# Altium project RaspComputeModule_4_IO.PrjPcb
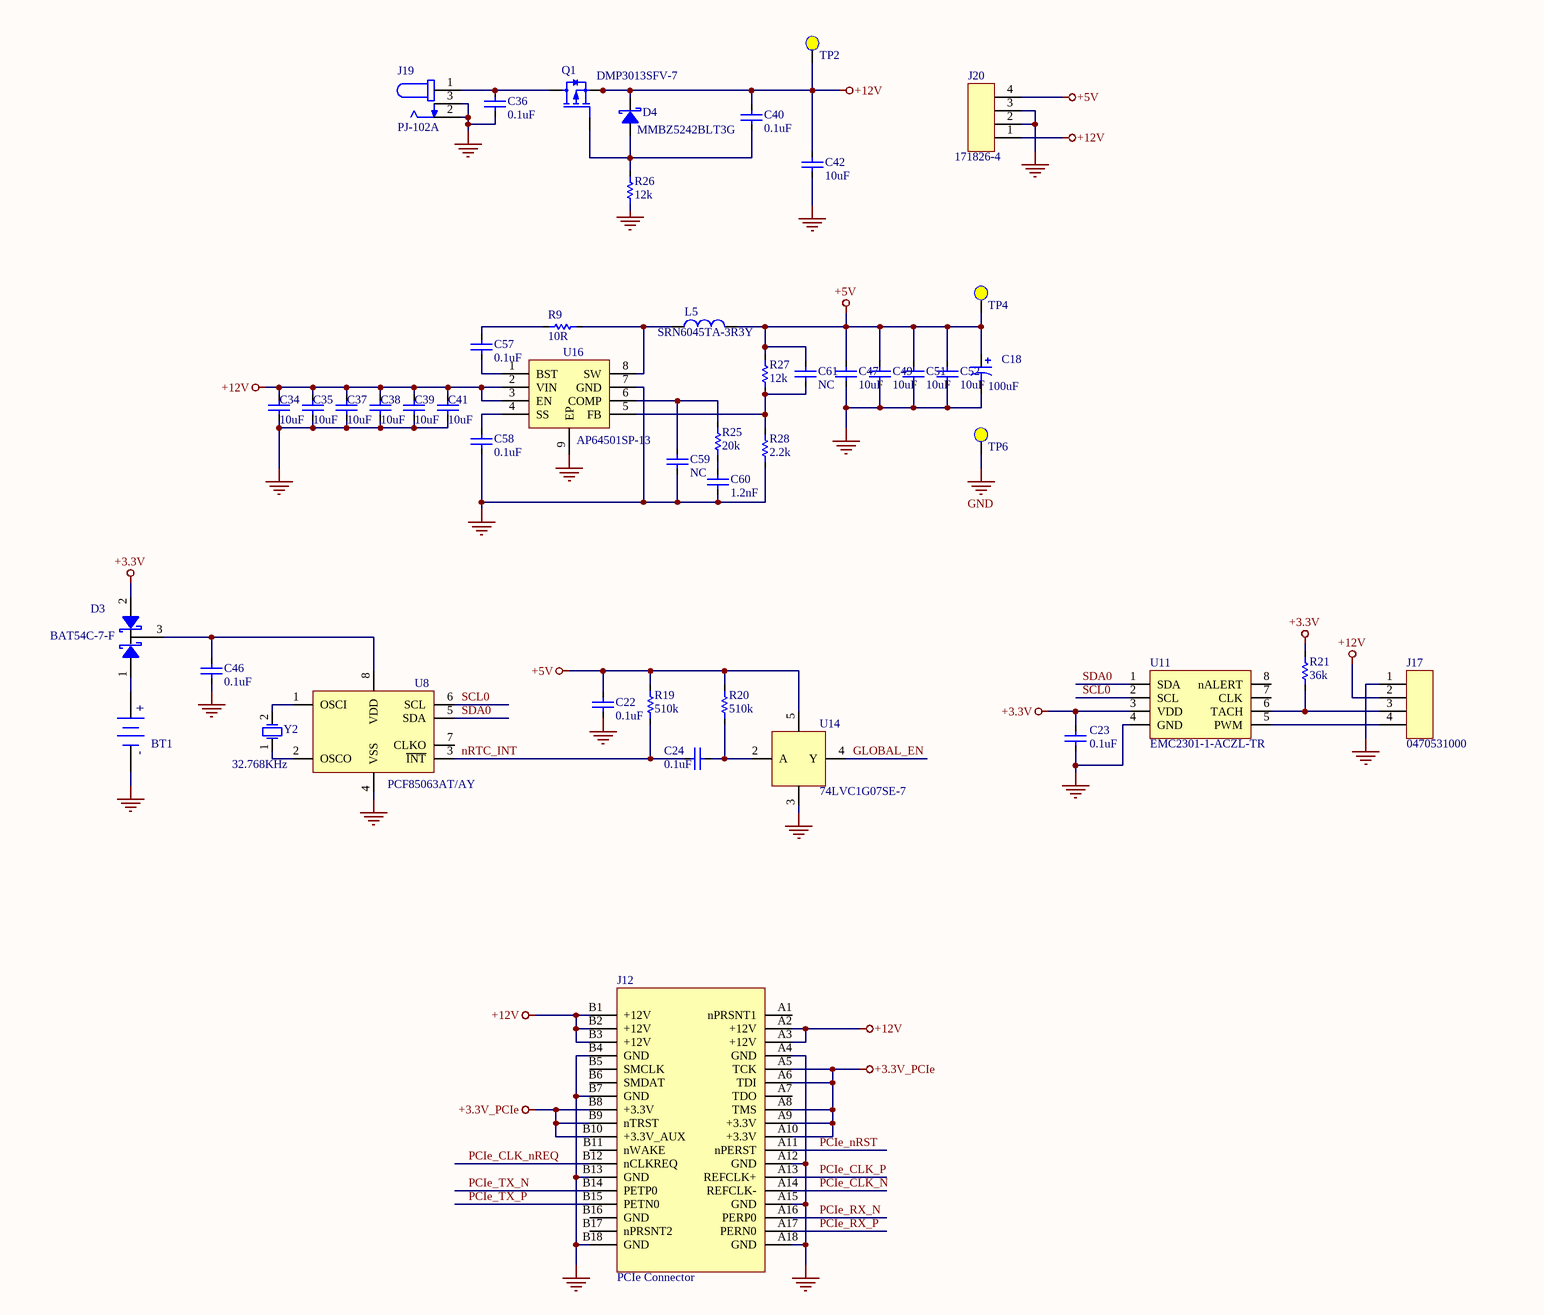
[diagram p0: RaspComputeModule_4_IO.SchDoc, top left]
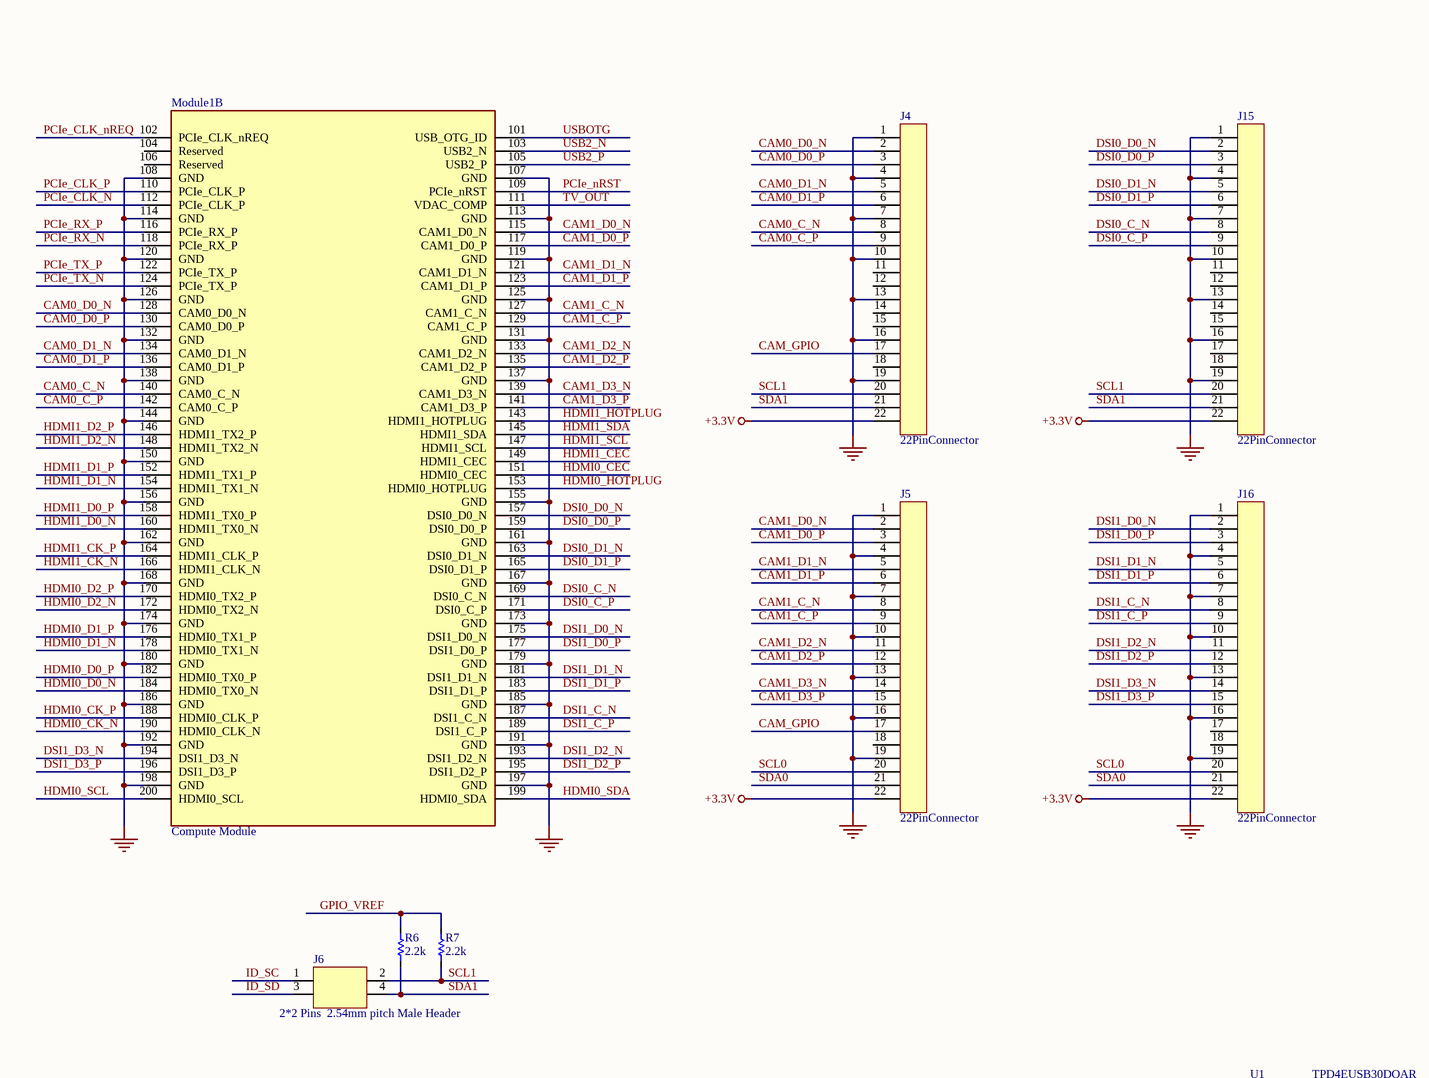
[diagram p1: RaspComputeModule_4_IO.SchDoc, top right]
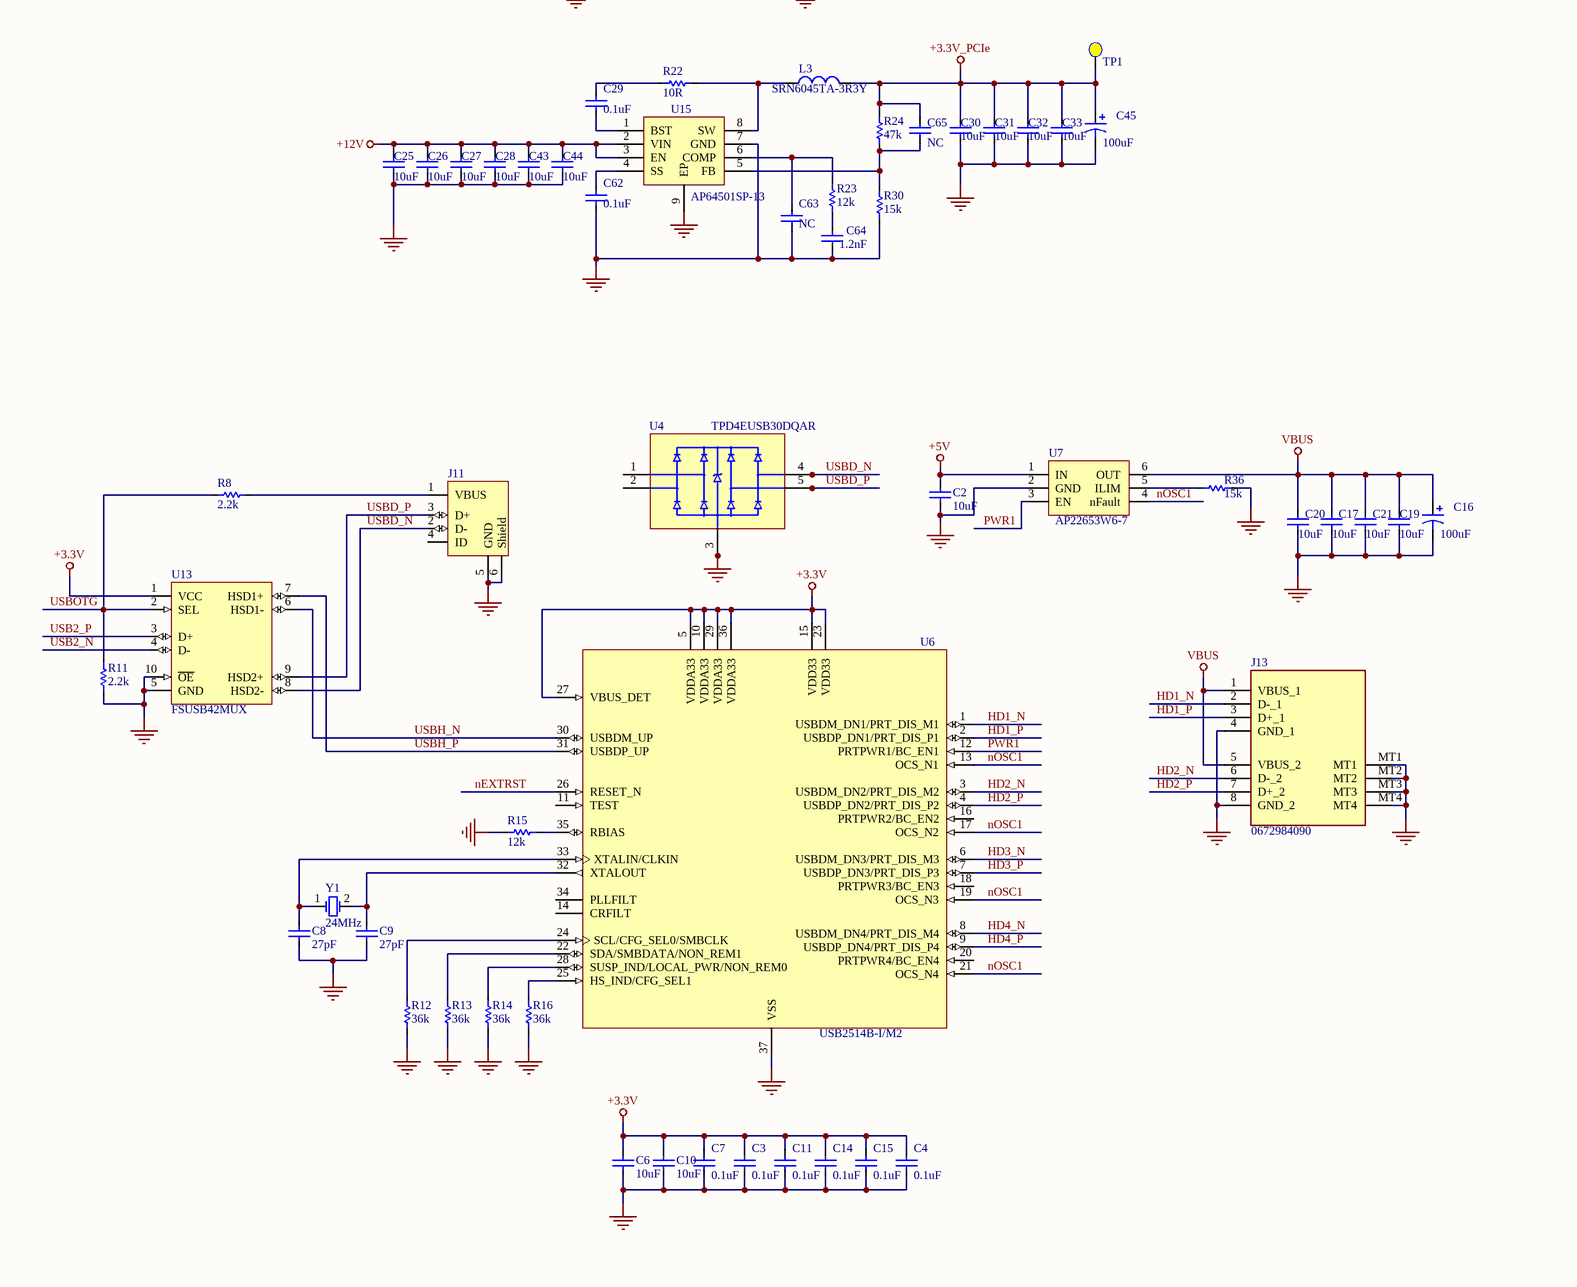
[diagram p2: RaspComputeModule_4_IO.SchDoc, bottom left]
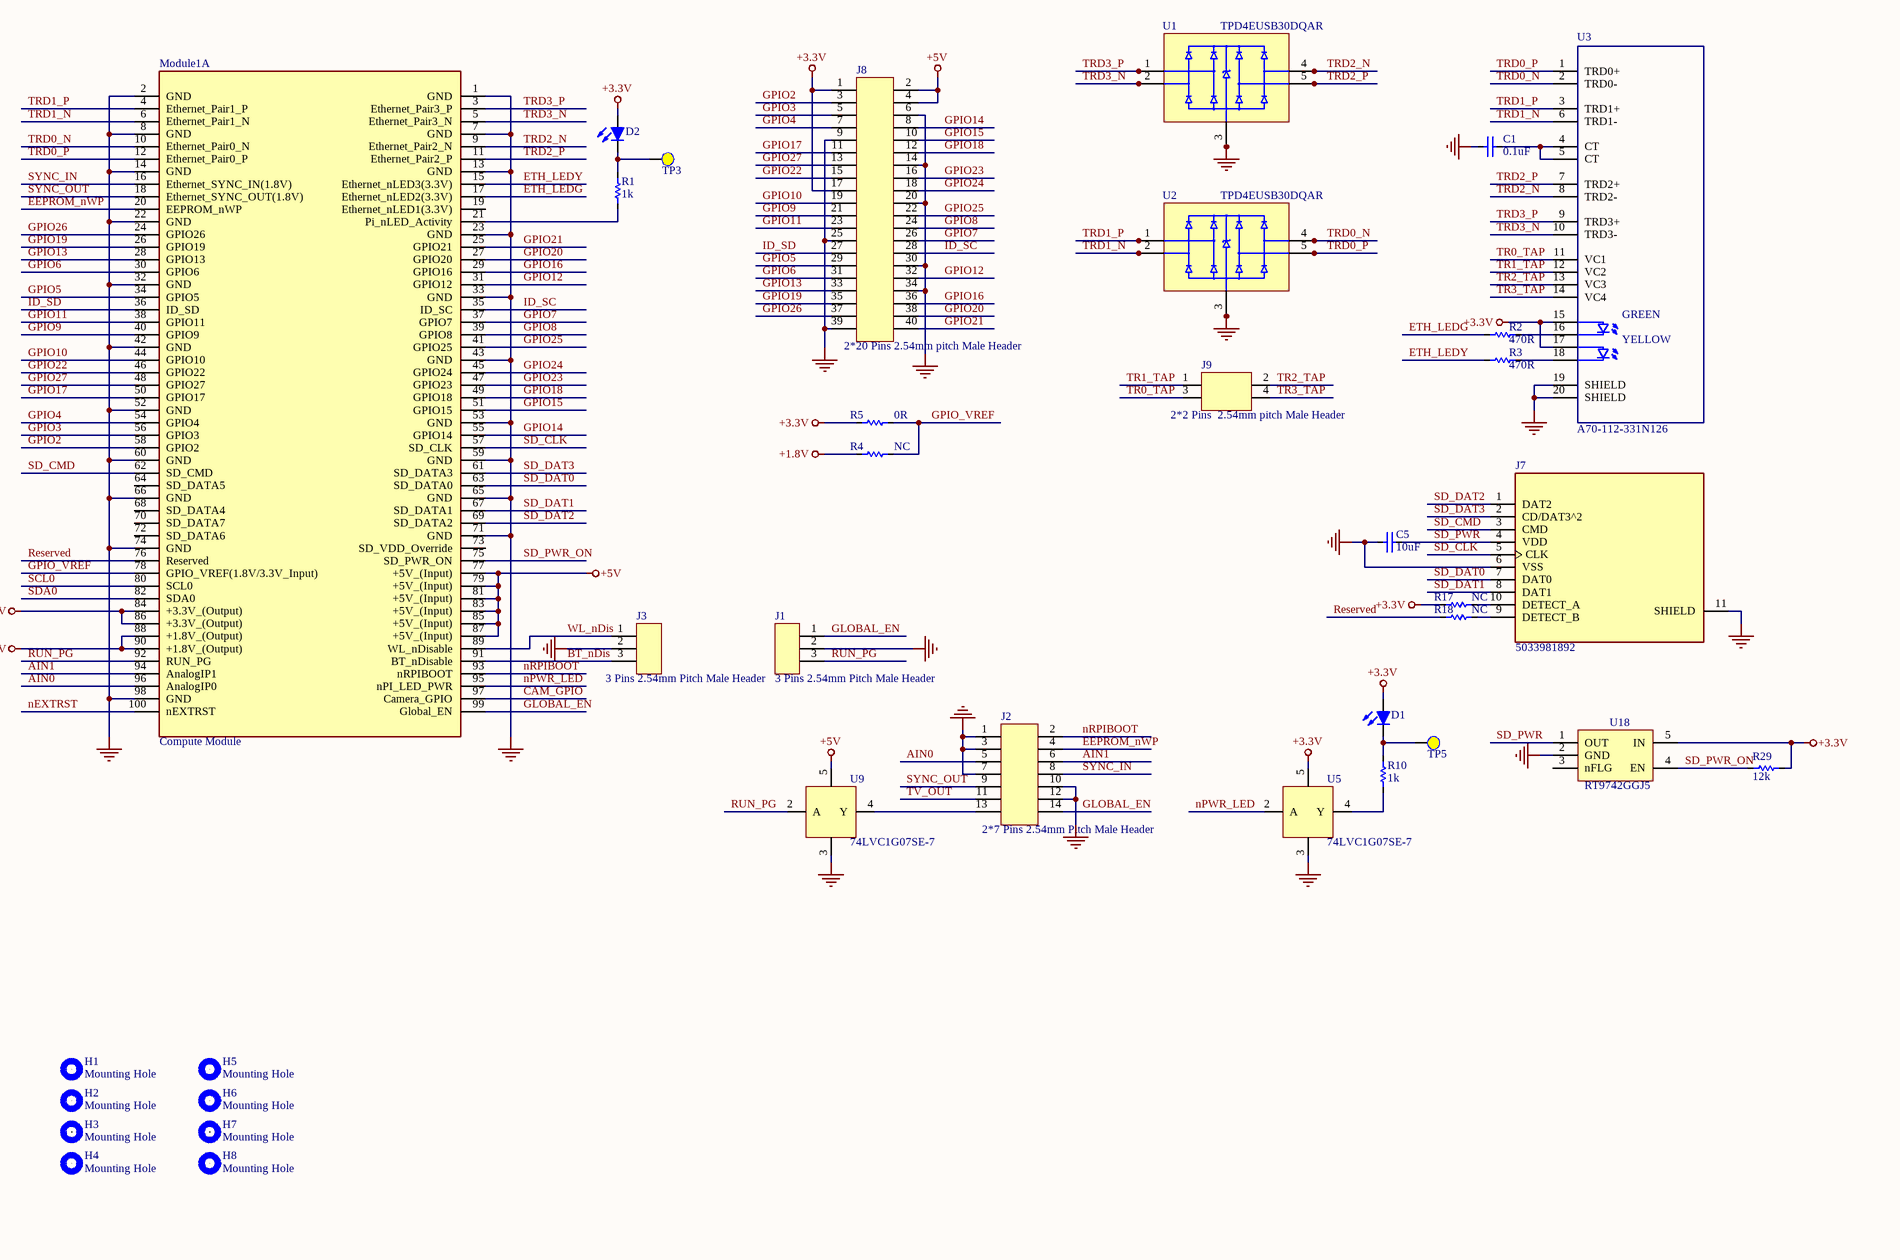
[diagram p3: RaspComputeModule_4_IO.SchDoc, bottom right]
2 sheets, 263 parts. Net scope: global (net labels, ports and power ports of the same name join across sheets).
Board files: Sim7600.PcbDoc, RaspComputeModule_4_IO.PcbDoc
Sheets:
  RaspComputeModule_4_IO.SchDoc
  SIM7600G.SchDoc

## Sheet RaspComputeModule_4_IO.SchDoc
size A1

### Parts
BT1  3034  [BatteryHolder_Keystone_3034_1x20mm]  (value not drawn)
C1  0.1uF  [C_0402_1005Metric]
C2  10uF  [C_0805_2012Metric]
C3  0.1uF  [C_0402_1005Metric]
C4  0.1uF  [C_0402_1005Metric]
C5  10uF  [C_0805_2012Metric]
C6  10uF  [C_0805_2012Metric]
C7  0.1uF  [C_0402_1005Metric]
C8  27pF  [C_0402_1005Metric]
C9  27pF  [C_0402_1005Metric]
C10  10uF  [C_0805_2012Metric]
C11  0.1uF  [C_0402_1005Metric]
C14  0.1uF  [C_0402_1005Metric]
C15  0.1uF  [C_0402_1005Metric]
C16  100uF  [CP_EIA-7343-31_Kemet-D]
C17  10uF  [C_0805_2012Metric]
C18  100uF  [CP_EIA-7343-31_Kemet-D]
C19  10uF  [C_0805_2012Metric]
C20  10uF  [C_0805_2012Metric]
C21  10uF  [C_0805_2012Metric]
C22  0.1uF  [C_0402_1005Metric]
C23  0.1uF  [C_0402_1005Metric]
C24  0.1uF  [C_0402_1005Metric]
C25  10uF  [C_0805_2012Metric]
C26  10uF  [C_0805_2012Metric]
C27  10uF  [C_0805_2012Metric]
C28  10uF  [C_0805_2012Metric]
C29  0.1uF  [C_0402_1005Metric]
C30  10uF  [C_0805_2012Metric]
C31  10uF  [C_0805_2012Metric]
C32  10uF  [C_0805_2012Metric]
C33  10uF  [C_0805_2012Metric]
C34  10uF  [C_0805_2012Metric]
C35  10uF  [C_0805_2012Metric]
C36  0.1uF  [C_0402_1005Metric]
C37  10uF  [C_0805_2012Metric]
C38  10uF  [C_0805_2012Metric]
C39  10uF  [C_0805_2012Metric]
C40  0.1uF  [C_0402_1005Metric]
C41  10uF  [C_0805_2012Metric]
C42  10uF  [C_0805_2012Metric]
C43  10uF  [C_0805_2012Metric]
C44  10uF  [C_0805_2012Metric]
C45  100uF  [CP_EIA-7343-31_Kemet-D]
C46  0.1uF  [C_0402_1005Metric]
C47  10uF  [C_0805_2012Metric]
C49  10uF  [C_0805_2012Metric]
C51  10uF  [C_0805_2012Metric]
C52  10uF  [C_0805_2012Metric]
C57  0.1uF  [C_0402_1005Metric]
C58  0.1uF  [C_0402_1005Metric]
C59  NC  [C_0402_1005Metric]
C60  1.2nF  [C_0402_1005Metric]
C61  NC  [C_0402_1005Metric]
C62  0.1uF  [C_0402_1005Metric]
C63  NC  [C_0402_1005Metric]
C64  1.2nF  [C_0402_1005Metric]
C65  NC  [C_0402_1005Metric]
D1  SML-D12U1WT86  [LED_0603_1608Metric]  (value not drawn)
D2  SML-D12U1WT86  [LED_0603_1608Metric]  (value not drawn)
D3  BAT54C-7-F  [SOT-23]
D4  MMBZ5242BLT3G  [D_SOT-23_ANK]
H1  Mounting Hole  [MountingHole_2.7mm_M2.5]
H2  Mounting Hole  [MountingHole_2.7mm_M2.5]
H3  Mounting Hole  [MountingHole_2.7mm_M2.5]
H4  Mounting Hole  [MountingHole_2.7mm_M2.5]
H5  Mounting Hole  [MountingHole_2.7mm_M2.5]
H6  Mounting Hole  [MountingHole_2.7mm_M2.5]
H7  Mounting Hole  [MountingHole_2.7mm_M2.5]
H8  Mounting Hole  [MountingHole_2.7mm_M2.5]
J1  3 Pins 2.54mm Pitch Male Header  [PinHeader_1x03_P2.54mm_Vertical]
J2  2*7 Pins 2.54mm Pitch Male Header  [PinHeader_2x07_P2.54mm_Vertical]
J3  3 Pins 2.54mm Pitch Male Header  [PinHeader_1x03_P2.54mm_Vertical]
J4  22PinConnector  [Hirose_FH12-22S-0.5SH_1x22-1MP_P0.50mm_Horizontal]
J5  22PinConnector  [Hirose_FH12-22S-0.5SH_1x22-1MP_P0.50mm_Horizontal]
J6  2*2 Pins  2.54mm pitch Male Header  [PinHeader_2x02_P2.54mm_Vertical]
J7  5033981892  [SDCARD_MOLEX_503398-1892]
J8  2*20 Pins 2.54mm pitch Male Header  [PinHeader_2x20_P2.54mm_Vertical]
J9  2*2 Pins  2.54mm pitch Male Header  [PinHeader_2x02_P2.54mm_Vertical]
J11  10118194-0001LF  [10118194-0001LF]  (value not drawn)
J12  PCIe Connector  [PCIex1-36]
J13  0672984090  [MOLEX_USB_67298-4090]
J15  22PinConnector  [Hirose_FH12-22S-0.5SH_1x22-1MP_P0.50mm_Horizontal]
J16  22PinConnector  [Hirose_FH12-22S-0.5SH_1x22-1MP_P0.50mm_Horizontal]
J17  0470531000  [FanPinHeader_1x04_P2.54mm_Vertical]
J19  PJ-102A  [CUI_PJ-102A]
J20  171826-4  [TE_171826-4]
L3  SRN6045TA-3R3Y  [L_Bourns_SRN6045TA]
L5  SRN6045TA-3R3Y  [L_Bourns_SRN6045TA]
Module1  Compute Module  [Raspberry-Pi-4-Compute-Module]  (parts A,B of 2)
Q1  DMP3013SFV-7  [Diodes_PowerDI3333-8]
R1  1k  [R_0402_1005Metric]
R2  470R  [R_0402_1005Metric]
R3  470R  [R_0402_1005Metric]
R4  NC  [R_0402_1005Metric]
R5  0R  [R_0402_1005Metric]
R6  2.2k  [R_0402_1005Metric]
R7  2.2k  [R_0402_1005Metric]
R8  2.2k  [R_0402_1005Metric]
R9  10R  [R_0402_1005Metric]
R10  1k  [R_0402_1005Metric]
R11  2.2k  [R_0402_1005Metric]
R12  36k  [R_0402_1005Metric]
R13  36k  [R_0402_1005Metric]
R14  36k  [R_0402_1005Metric]
R15  12k  [R_0402_1005Metric]
R16  36k  [R_0402_1005Metric]
R17  NC  [R_0402_1005Metric]
R18  NC  [R_0402_1005Metric]
R19  510k  [R_0402_1005Metric]
R20  510k  [R_0402_1005Metric]
R21  36k  [R_0402_1005Metric]
R22  10R  [R_0402_1005Metric]
R23  12k  [R_0402_1005Metric]
R24  47k  [R_0402_1005Metric]
R25  20k  [R_0402_1005Metric]
R26  12k  [R_0402_1005Metric]
R27  12k  [R_0402_1005Metric]
R28  2.2k  [R_0402_1005Metric]
R29  12k  [R_0402_1005Metric]
R30  15k  [R_0402_1005Metric]
R36  15k  [R_0402_1005Metric]
TP1  testpoint  [TestPoint_Pad_2.0x2.0mm]  (value not drawn)
TP2  testpoint  [TestPoint_Pad_2.0x2.0mm]  (value not drawn)
TP3  testpoint  [TestPoint_Pad_2.0x2.0mm]  (value not drawn)
TP4  testpoint  [TestPoint_Pad_2.0x2.0mm]  (value not drawn)
TP5  testpoint  [TestPoint_Pad_2.0x2.0mm]  (value not drawn)
TP6  testpoint  [TestPoint_Pad_2.0x2.0mm]  (value not drawn)
U1  TPD4EUSB30DQAR  [USON-10_2.5x1.0mm_P0.5mm]
U2  TPD4EUSB30DQAR  [USON-10_2.5x1.0mm_P0.5mm]
U3  A70-112-331N126  [TRJG0926HENL]
U4  TPD4EUSB30DQAR  [USON-10_2.5x1.0mm_P0.5mm]
U5  74LVC1G07SE-7  [SOT-353_SC-70-5]
U6  USB2514B-I/M2  [QFN-36-1EP_6x6mm_P0.5mm_EP3.7x3.7mm]
U7  AP22653W6-7  [SOT-23-6]
U8  PCF85063AT/AY  [SOIC-8_3.9x4.9mm_P1.27mm]
U9  74LVC1G07SE-7  [SOT-353_SC-70-5]
U11  EMC2301-1-ACZL-TR  [MSOP-8_3x3mm_P0.65mm]
U13  FSUSB42MUX  [MSOP-10_3x3mm_P0.5mm]
U14  74LVC1G07SE-7  [SOT-353_SC-70-5]
U15  AP64501SP-13  [SOIC-8-1EP_3.9x4.9mm_P1.27mm_EP2.95x4.9mm_Mask2.71x3.4mm_ThermalVias]
U16  AP64501SP-13  [SOIC-8-1EP_3.9x4.9mm_P1.27mm_EP2.95x4.9mm_Mask2.71x3.4mm_ThermalVias]
U18  RT9742GGJ5  [SOT-23-5]
Y1  24MHz  [Crystal_SMD_HC49-SD]
Y2  32.768KHz  [Crystal_SMD_3215-2Pin_3.2x1.5mm]

### Nets
+1.8V: Module1.88(+1.8V_(Output)) Module1.90(+1.8V_(Output)) R4.1
+3.3V: C3.1 C4.1 C6.1 C7.1 C10.1 C11.1 C14.1 C15.1 C23.1 D1.2(A) D2.2(A) D3.2 J4.22 J5.22 J8.1 J8.17 J15.22 J16.22 Module1.84(+3.3V_(Output)) Module1.86(+3.3V_(Output)) R5.1 R17.1 R21.2 R29.1 U3.15(G_A) U3.17(Y_A) U5.5(VCC) U6.5(VDDA33) U6.10(VDDA33) U6.15(VDD33) U6.23(VDD33) U6.27(VBUS_DET) U6.29(VDDA33) U6.36(VDDA33) U11.3(VDD) U13.1(VCC) U18.5(IN)
+3.3V_PCIe: C30.1 C31.1 C32.1 C33.1 C45.1 C65.1 J12.A5(TCK) J12.A6(TDI) J12.A8(TMS) J12.A9(+3.3V) J12.A10(+3.3V) J12.B8(+3.3V) J12.B9(nTRST) J12.B10(+3.3V_AUX) L3.2 R24.1 TP1.1
+5V: C2.1 C18.1 C22.1 C47.1 C49.1 C51.1 C52.1 C61.1 J8.2 J8.4 J20.4 L5.2 Module1.77(+5V_(Input)) Module1.79(+5V_(Input)) Module1.81(+5V_(Input)) Module1.83(+5V_(Input)) Module1.85(+5V_(Input)) Module1.87(+5V_(Input)) R19.2 R20.2 R27.1 TP4.1 U7.1(IN) U9.5(VCC) U14.5(VCC)
+12V: C25.1 C26.1 C27.1 C28.1 C34.1 C35.1 C37.1 C38.1 C39.1 C40.1 C41.1 C42.1 C43.1 C44.1 D4.1(K) J12.A2(+12V) J12.A3(+12V) J12.B1(+12V) J12.B2(+12V) J12.B3(+12V) J17.2 J20.1 Q1.1(S) Q1.2(S) Q1.3(S) TP2.1 U15.2(VIN) U15.3(EN) U16.2(VIN) U16.3(EN)
GND: BT1.2(-) C1.2 C2.2 C3.2 C4.2 C5.2 C6.2 C7.2 C8.2 C9.2 C10.2 C11.2 C14.2 C15.2 C16.2 C17.2 C18.2 C19.2 C20.2 C21.2 C22.2 C23.2 C25.2 C26.2 C27.2 C28.2 C30.2 C31.2 C32.2 C33.2 C34.2 C35.2 C36.2 C37.2 C38.2 C39.2 C41.2 C42.2 C43.2 C44.2 C45.2 C46.2 C47.2 C49.2 C51.2 C52.2 C58.2 C59.2 C60.2 C62.2 C63.2 C64.2 J1.2 J2.1 J2.3 J2.7 J2.10 J2.12 J3.2 J4.1 J4.4 J4.7 J4.10 J4.13 J4.16 J4.19 J5.1 J5.4 J5.7 J5.10 J5.13 J5.16 J5.19 J7.6(VSS) J7.11(SHIELD) J8.6 J8.9 J8.14 J8.20 J8.25 J8.30 J8.34 J8.39 J11.5(GND) J11.6(Shield) J12.A4(GND) J12.A12(GND) J12.A15(GND) J12.A18(GND) J12.B4(GND) J12.B7(GND) J12.B13(GND) J12.B18(GND) J13.4(GND_1) J13.8(GND_2) J13.MT1 J13.MT2 J13.MT3 J13.MT4 J15.1 J15.4 J15.7 J15.10 J15.13 J15.16 J15.19 J16.1 J16.4 J16.7 J16.10 J16.13 J16.16 J16.19 J17.1 J19.2 J19.3 J20.2 J20.3 Module1.1(GND) Module1.2(GND) Module1.7(GND) Module1.8(GND) Module1.13(GND) Module1.14(GND) Module1.22(GND) Module1.23(GND) Module1.32(GND) Module1.33(GND) Module1.42(GND) Module1.43(GND) Module1.52(GND) Module1.53(GND) Module1.59(GND) Module1.60(GND) Module1.65(GND) Module1.66(GND) Module1.71(GND) Module1.74(GND) Module1.98(GND) Module1.107(GND) Module1.108(GND) Module1.113(GND) Module1.114(GND) Module1.119(GND) Module1.120(GND) Module1.125(GND) Module1.126(GND) Module1.131(GND) Module1.132(GND) Module1.137(GND) Module1.138(GND) Module1.144(GND) Module1.150(GND) Module1.155(GND) Module1.156(GND) Module1.161(GND) Module1.162(GND) Module1.167(GND) Module1.168(GND) Module1.173(GND) Module1.174(GND) Module1.179(GND) Module1.180(GND) Module1.185(GND) Module1.186(GND) Module1.191(GND) Module1.192(GND) Module1.197(GND) Module1.198(GND) R11.2 R12.2 R13.2 R14.2 R15.1 R16.2 R26.2 R28.2 R30.2 R36.2 TP6.1 U1.3(GND_3) U1.8(GND_8) U2.3(GND_3) U2.8(GND_8) U3.19(SHIELD) U3.20(SHIELD) U4.3(GND_3) U4.8(GND_8) U5.3(GND) U6.37(VSS) U7.2(GND) U8.4(VSS) U9.3(GND) U11.4(GND) U13.5(GND) U13.10(~{OE}) U14.3(GND) U15.7(GND) U15.9(EP) U16.7(GND) U16.9(EP) U18.2(GND)
VBUS: C16.1 C17.1 C19.1 C20.1 C21.1 J13.1(VBUS_1) J13.5(VBUS_2) U7.6(OUT)
AIN0: J2.5 Module1.96(AnalogIP0)
AIN1: J2.6 Module1.94(AnalogIP1)
BT_nDis: J3.3 Module1.91(BT_nDisable)
CAM0_C_N: J4.8 Module1.140(CAM0_C_N)
CAM0_C_P: J4.9 Module1.142(CAM0_C_P)
CAM0_D0_N: J4.2 Module1.128(CAM0_D0_N)
CAM0_D0_P: J4.3 Module1.130(CAM0_D0_P)
CAM0_D1_N: J4.5 Module1.134(CAM0_D1_N)
CAM0_D1_P: J4.6 Module1.136(CAM0_D1_P)
CAM1_C_N: J5.8 Module1.127(CAM1_C_N)
CAM1_C_P: J5.9 Module1.129(CAM1_C_P)
CAM1_D0_N: J5.2 Module1.115(CAM1_D0_N)
CAM1_D0_P: J5.3 Module1.117(CAM1_D0_P)
CAM1_D1_N: J5.5 Module1.121(CAM1_D1_N)
CAM1_D1_P: J5.6 Module1.123(CAM1_D1_P)
CAM1_D2_N: J5.11 Module1.133(CAM1_D2_N)
CAM1_D2_P: J5.12 Module1.135(CAM1_D2_P)
CAM1_D3_N: J5.14 Module1.139(CAM1_D3_N)
CAM1_D3_P: J5.15 Module1.141(CAM1_D3_P)
CAM_GPIO: J4.17 J5.17 Module1.97(Camera_GPIO)
DSI0_C_N: J15.8 Module1.169(DSI0_C_N)
DSI0_C_P: J15.9 Module1.171(DSI0_C_P)
DSI0_D0_N: J15.2 Module1.157(DSI0_D0_N)
DSI0_D0_P: J15.3 Module1.159(DSI0_D0_P)
DSI0_D1_N: J15.5 Module1.163(DSI0_D1_N)
DSI0_D1_P: J15.6 Module1.165(DSI0_D1_P)
DSI1_C_N: J16.8 Module1.187(DSI1_C_N)
DSI1_C_P: J16.9 Module1.189(DSI1_C_P)
DSI1_D0_N: J16.2 Module1.175(DSI1_D0_N)
DSI1_D0_P: J16.3 Module1.177(DSI1_D0_P)
DSI1_D1_N: J16.5 Module1.181(DSI1_D1_N)
DSI1_D1_P: J16.6 Module1.183(DSI1_D1_P)
DSI1_D2_N: J16.11 Module1.193(DSI1_D2_N)
DSI1_D2_P: J16.12 Module1.195(DSI1_D2_P)
DSI1_D3_N: J16.14 Module1.194(DSI1_D3_N)
DSI1_D3_P: J16.15 Module1.196(DSI1_D3_P)
EEPROM_nWP: J2.4 Module1.20(EEPROM_nWP)
ETH_LEDG: Module1.17(Ethernet_nLED2(3.3V)) R2.2
ETH_LEDY: Module1.15(Ethernet_nLED3(3.3V)) R3.2
GLOBAL_EN: J1.1 J2.14 Module1.99(Global_EN) U14.4(Y)
GPIO2: J8.3 Module1.58(GPIO2)
GPIO3: J8.5 Module1.56(GPIO3)
GPIO4: J8.7 Module1.54(GPIO4)
GPIO5: J8.29 Module1.34(GPIO5)
GPIO6: J8.31 Module1.30(GPIO6)
GPIO7: J8.26 Module1.37(GPIO7)
GPIO8: J8.24 Module1.39(GPIO8)
GPIO9: J8.21 Module1.40(GPIO9)
GPIO10: J8.19 Module1.44(GPIO10)
GPIO11: J8.23 Module1.38(GPIO11)
GPIO12: J8.32 Module1.31(GPIO12)
GPIO13: J8.33 Module1.28(GPIO13)
GPIO14: J8.8 Module1.55(GPIO14)
GPIO15: J8.10 Module1.51(GPIO15)
GPIO16: J8.36 Module1.29(GPIO16)
GPIO17: J8.11 Module1.50(GPIO17)
GPIO18: J8.12 Module1.49(GPIO18)
GPIO19: J8.35 Module1.26(GPIO19)
GPIO20: J8.38 Module1.27(GPIO20)
GPIO21: J8.40 Module1.25(GPIO21)
GPIO22: J8.15 Module1.46(GPIO22)
GPIO23: J8.16 Module1.47(GPIO23)
GPIO24: J8.18 Module1.45(GPIO24)
GPIO25: J8.22 Module1.41(GPIO25)
GPIO26: J8.37 Module1.24(GPIO26)
GPIO27: J8.13 Module1.48(GPIO27)
GPIO_VREF: Module1.78(GPIO_VREF(1.8V/3.3V_Input)) R4.2 R5.2 R6.1 R7.1
HD1_N: J13.2(D-_1) U6.1(USBDM_DN1/PRT_DIS_M1)
HD1_P: J13.3(D+_1) U6.2(USBDP_DN1/PRT_DIS_P1)
HD2_N: J13.6(D-_2) U6.3(USBDM_DN2/PRT_DIS_M2)
HD2_P: J13.7(D+_2) U6.4(USBDP_DN2/PRT_DIS_P2)
HD3_N: U6.6(USBDM_DN3/PRT_DIS_M3)
HD3_P: U6.7(USBDP_DN3/PRT_DIS_P3)
HD4_N: U6.8(USBDM_DN4/PRT_DIS_M4)
HD4_P: U6.9(USBDP_DN4/PRT_DIS_P4)
HDMI0_CEC: Module1.151(HDMI0_CEC)
HDMI0_CK_N: Module1.190(HDMI0_CLK_N)
HDMI0_CK_P: Module1.188(HDMI0_CLK_P)
HDMI0_D0_N: Module1.184(HDMI0_TX0_N)
HDMI0_D0_P: Module1.182(HDMI0_TX0_P)
HDMI0_D1_N: Module1.178(HDMI0_TX1_N)
HDMI0_D1_P: Module1.176(HDMI0_TX1_P)
HDMI0_D2_N: Module1.172(HDMI0_TX2_N)
HDMI0_D2_P: Module1.170(HDMI0_TX2_P)
HDMI0_HOTPLUG: Module1.153(HDMI0_HOTPLUG)
HDMI0_SCL: Module1.200(HDMI0_SCL)
HDMI0_SDA: Module1.199(HDMI0_SDA)
HDMI1_CEC: Module1.149(HDMI1_CEC)
HDMI1_CK_N: Module1.166(HDMI1_CLK_N)
HDMI1_CK_P: Module1.164(HDMI1_CLK_P)
HDMI1_D0_N: Module1.160(HDMI1_TX0_N)
HDMI1_D0_P: Module1.158(HDMI1_TX0_P)
HDMI1_D1_N: Module1.154(HDMI1_TX1_N)
HDMI1_D1_P: Module1.152(HDMI1_TX1_P)
HDMI1_D2_N: Module1.148(HDMI1_TX2_N)
HDMI1_D2_P: Module1.146(HDMI1_TX2_P)
HDMI1_HOTPLUG: Module1.143(HDMI1_HOTPLUG)
HDMI1_SCL: Module1.147(HDMI1_SCL)
HDMI1_SDA: Module1.145(HDMI1_SDA)
ID_SC: J6.1 J8.28 Module1.35(ID_SC)
ID_SD: J6.3 J8.27 Module1.36(ID_SD)
nEXTRST: Module1.100(nEXTRST) U6.26(RESET_N)
nOSC1: U6.13(OCS_N1) U6.17(OCS_N2) U6.19(OCS_N3) U6.21(OCS_N4) U7.4(nFault)
nPWR_LED: Module1.95(nPI_LED_PWR) U5.2(A)
nRPIBOOT: J2.2 Module1.93(nRPIBOOT)
nRTC_INT: C24.2 R19.1 U8.3(~{INT})
PCIe_CLK_N: J12.A14(REFCLK-) Module1.112(PCIe_CLK_P)
PCIe_CLK_nREQ: J12.B12(nCLKREQ) Module1.102(PCIe_CLK_nREQ)
PCIe_CLK_P: J12.A13(REFCLK+) Module1.110(PCIe_CLK_P)
PCIe_nRST: J12.A11(nPERST) Module1.109(PCIe_nRST)
PCIe_RX_N: J12.A16(PERP0) Module1.118(PCIe_RX_P)
PCIe_RX_P: J12.A17(PERN0) Module1.116(PCIe_RX_P)
PCIe_TX_N: J12.B14(PETP0) Module1.124(PCIe_TX_P)
PCIe_TX_P: J12.B15(PETN0) Module1.122(PCIe_TX_P)
PWR1: U6.12(PRTPWR1/BC_EN1) U7.3(EN)
Reserved: Module1.76(Reserved) R18.1
RUN_PG: J1.3 Module1.92(RUN_PG) U9.2(A)
SCL0: J5.20 J16.20 Module1.80(SCL0) U8.6(SCL) U11.2(SCL)
SCL1: J4.20 J6.2 J15.20 R7.2
SD_CLK: J7.5(CLK) Module1.57(SD_CLK)
SD_CMD: J7.3(CMD) Module1.62(SD_CMD)
SD_DAT0: J7.7(DAT0) Module1.63(SD_DATA0)
SD_DAT1: J7.8(DAT1) Module1.67(SD_DATA1)
SD_DAT2: J7.1(DAT2) Module1.69(SD_DATA2)
SD_DAT3: J7.2(CD/DAT3^2) Module1.61(SD_DATA3)
SD_PWR: C5.1 J7.4(VDD) U18.1(OUT)
SD_PWR_ON: Module1.75(SD_PWR_ON) R29.2 U18.4(EN)
SDA0: J5.21 J16.21 Module1.82(SDA0) U8.5(SDA) U11.1(SDA)
SDA1: J4.21 J6.4 J15.21 R6.2
SYNC_IN: J2.8 Module1.16(Ethernet_SYNC_IN(1.8V))
SYNC_OUT: J2.9 Module1.18(Ethernet_SYNC_OUT(1.8V))
TR0_TAP: J9.3 U3.11(VC1)
TR1_TAP: J9.1 U3.12(VC2)
TR2_TAP: J9.2 U3.13(VC3)
TR3_TAP: J9.4 U3.14(VC4)
TRD0_N: Module1.10(Ethernet_Pair0_N) U2.4(D2+) U2.7(NC_7) U3.2(TRD0-)
TRD0_P: Module1.12(Ethernet_Pair0_P) U2.5(D2-) U2.6(NC_6) U3.1(TRD0+)
TRD1_N: Module1.6(Ethernet_Pair1_N) U2.2(D1-) U2.9(NC_9) U3.6(TRD1-)
TRD1_P: Module1.4(Ethernet_Pair1_P) U2.1(D1+) U2.10(NC_10) U3.3(TRD1+)
TRD2_N: Module1.9(Ethernet_Pair2_N) U1.4(D2+) U1.7(NC_7) U3.8(TRD2-)
TRD2_P: Module1.11(Ethernet_Pair2_P) U1.5(D2-) U1.6(NC_6) U3.7(TRD2+)
TRD3_N: Module1.5(Ethernet_Pair3_N) U1.2(D1-) U1.9(NC_9) U3.10(TRD3-)
TRD3_P: Module1.3(Ethernet_Pair3_P) U1.1(D1+) U1.10(NC_10) U3.9(TRD3+)
TV_OUT: J2.11 Module1.111(VDAC_COMP)
USB2_N: Module1.103(USB2_N) U13.4(D-)
USB2_P: Module1.105(USB2_P) U13.3(D+)
USBD_N: J11.2(D-) U4.4(D2+) U4.7(NC_7) U13.8(HSD2-)
USBD_P: J11.3(D+) U4.5(D2-) U4.6(NC_6) U13.9(HSD2+)
USBH_N: U6.30(USBDM_UP) U13.6(HSD1-)
USBH_P: U6.31(USBDP_UP) U13.7(HSD1+)
USBOTG: Module1.101(USB_OTG_ID) R8.2 R11.1 U13.2(SEL)
WL_nDis: J3.1 Module1.89(WL_nDisable)
NetBT1_1: BT1.1(+) D3.1
NetC1_1: C1.1 U3.4(CT) U3.5(CT)
NetC8_1: C8.1 U6.33(XTALIN/CLKIN) Y1.1(OSC1)
NetC9_1: C9.1 U6.32(XTALOUT) Y1.2(OSC2)
NetC24_1: C24.1 R20.1 U14.2(A)
NetC29_1: C29.1 R22.2
NetC29_2: C29.2 U15.1(BST)
NetC36_1: C36.1 J19.1 Q1.5(D)
NetC40_2: C40.2 D4.2(A) Q1.4(G) R26.1
NetC46_1: C46.1 D3.3 U8.8(VDD)
NetC57_1: C57.1 R9.2
NetC57_2: C57.2 U16.1(BST)
NetC58_1: C58.1 U16.4(SS)
NetC59_1: C59.1 R25.1 U16.6(COMP)
NetC60_1: C60.1 R25.2
NetC61_2: C61.2 R27.2 R28.1 U16.5(FB)
NetC62_1: C62.1 U15.4(SS)
NetC63_1: C63.1 R23.1 U15.6(COMP)
NetC64_1: C64.1 R23.2
NetC65_2: C65.2 R24.2 R30.1 U15.5(FB)
NetD1_1: D1.1(K) R10.1 TP5.1
NetD2_1: D2.1(K) R1.1 TP3.1
NetJ2_13: J2.13 U9.4(Y)
NetJ7_9: J7.9(DETECT_B) R18.2
NetJ7_10: J7.10(DETECT_A) R17.2
NetJ11_1: J11.1(VBUS) R8.1
NetJ17_3: J17.3 R21.1 U11.6(TACH)
NetJ17_4: J17.4 U11.5(PWM)
NetL3_1: L3.1 R22.1 U15.8(SW)
NetL5_1: L5.1 R9.1 U16.8(SW)
NetModule1_21: Module1.21(Pi_nLED_Activity) R1.2
NetR2_1: R2.1 U3.16(G_K)
NetR3_1: R3.1 U3.18(Y_K)
NetR10_2: R10.2 U5.4(Y)
NetR12_1: R12.1 U6.24(SCL/CFG_SEL0/SMBCLK)
NetR13_1: R13.1 U6.22(SDA/SMBDATA/NON_REM1)
NetR14_1: R14.1 U6.28(SUSP_IND/LOCAL_PWR/NON_REM0)
NetR15_2: R15.2 U6.35(RBIAS)
NetR16_1: R16.1 U6.25(HS_IND/CFG_SEL1)
NetR36_1: R36.1 U7.5(ILIM)
NetU4_1: U4.1(D1+) U4.10(NC_10)
NetU4_2: U4.2(D1-) U4.9(NC_9)
NetU8_1: U8.1(OSCI) Y2.2(OSC2)
NetU8_2: U8.2(OSCO) Y2.1(OSC1)

Not connected (* = marked no-connect by the designer): H1 Un1; H2 Un1; H3 Un1; H4 Un1; H5 Un1; H6 Un1; H7 Un1; H8 Un1; J4 11 12 14 15 18; J5 18; J11 4(ID); J12 A1(nPRSNT1) A7(TDO) B5(SMCLK) B6(SMDAT) B11(nWAKE) B16(GND) B17(nPRSNT2); J15 11 12 14 15 17 18; J16 17 18; Module1 19(Ethernet_nLED1(3.3V)) 64(SD_DATA5) 68(SD_DATA4) 70(SD_DATA7) 72(SD_DATA6) 73(SD_VDD_Override) 104(Reserved) 106(Reserved); U6 11(TEST) 14(CRFILT) 16(PRTPWR2/BC_EN2) 18(PRTPWR3/BC_EN3) 20(PRTPWR4/BC_EN4) 34(PLLFILT); U8 7(CLKO); U11 7(CLK) 8(nALERT); U18 3(nFLG)

### Notes on the sheet
- (in symbol A70-112-331N126) GREEN; YELLOW

### Library data of the parts
BT1 = BATTERY_18650: BATTERY RETAINER COIN 20MM SMD; Manufacturer: Keystone Electronics; Manufacturer Part Number: 3034; Supplier: Digi-Key; Supplier Part Number: 36-3034-ND; Value: 3034
C1 C3 C4 C7 C11 C14 C15 C22-C24 C29 C36 C40 C46 C57 C58 C62 = Cap: 0.1µF ±10% 50V; Manufacturer: Yageo; Manufacturer Part Number: CC0402KRX5R9BB104; Supplier: Digi-Key; Supplier Part Number: 311-3342-1-ND; Value: 0.1uF
C2 C5 C6 C10 C17 C19-C21 C25-C28 C30-C35 C37-C39 C41-C44 C47 C49 C51 C52 = Cap: 10µF ±10% 35V; Manufacturer: Murata; Manufacturer Part Number: GRM21BR6YA106KE43L; Supplier: Digi-Key; Supplier Part Number: 490-10514-1-ND; Vaule: 10uF
C8 C9 = Cap: 27pF ±1% 50V; Manufacturer: Yageo; Manufacturer Part Number: CC0402FRNPO9BN270; Supplier: Digi-Key; Supplier Part Number: 311-1644-1-ND; Value: 27pF
C16 C18 C45 = Cap Pol1: CAP TANT 100UF 20% 10V 2917; Manufacturer Part Number: TAJD107M010RNJ; Manufacturer: AVX Corporation; Supplier: Digi-Key; Supplier Part Number: 478-3918-1-ND; Value: 100uF
C59 C61 C63 C65 = Cap: Value: NC
C60 C64 = Cap: 1200pF ±10% 50V; Manufacturer: Murata; Manufacturer Part Number: GRM155R71H122KA01J; Supplier: Digi-Key; Supplier Part Number: 490-6352-1-ND; Value: 1.2nF
D1 D2 = LED1: LED RED DIFFUSED 0603 SMD; Manufacturer: Rohm Semiconductor; Supplier: Digi-Key; Supplier Part Number: SML-D12U1WT86CT-ND; Manufacturer Part Number: SML-D12U1WT86; Value: SML-D12U1WT86
D3 = BAT54C-7-F: DIODE ARRAY SCHOTTKY 30V SOT323; Manufacturer: ON Semiconductor; Manufacturer Part Number: BAT54CWT1G; Value: BAT54C-7-F; Supplier Part Number: BAT54CWT1GOSCT-ND; Supplier: Digi-Key
D4 = Diode 10TQ035: DIODE ZENER 12V 225MW SOT23-3; Manufacturer: ON Semiconductor; Value: MMBZ5242BLT3G; Manufacturer Part Number: MMBZ5242BLT3G; Supplier: Digi-Key; Supplier Part Number: MMBZ5242BLT3GOSCT-ND
J1 J3 = 3PinConnector: Manufacturer: Any; Manufacturer Part Number: Any; Supplier: Any; Supplier Part Number: Any; Value: 3 Pins 2.54mm Pitch Male Header
J2 = 14PinConnector: Manufacturer: Any; Manufacturer Part Number: Any; Supplier: Any; Supplier Part Number: Any; Value: 2*7 Pins 2.54mm Pitch Male Header
J4 J5 J15 J16 = 22PinConnector: CONN FFC BOTTOM 22POS 0.50MM R/A; Manufacturer: Hirose Electric Co Ltd; Manufacturer Part Number: FH12-22S-0.5SH(55); Value: FH12-22S-0.5SH(55); Supplier: Digi-Key; Supplier Part Number: HFJ122CT-ND
J6 J9 = 2*2 Pin Header: Manufacuturer: Any; Manufactuer Part Number: Any; Supplier: Any; Supplier Part Number: Any; Value: 2*2 Pins  2.54mm pitch Male Header
J7 = 503398-1892: MICRO SD PUSH/PUSH NORMAL 1.28MM 8C; Manufacturer: Molex; Manufacturer Part Number: 5033981892; Supplier: Digi-Key; Supplier Part Number: WM11190CT-ND; Value: 5033981892
J8 = 40PinConnector: Manufacturer: Any; Manufacturer Part Number: Any; Supplier: Any; Supplier Part Number: Any; Value: 2*20 Pins 2.54mm pitch Male Header
J11 = 10118194-0001LF: CONN RCPT USB2.0 MICRO B SMD R/A; Manufacturer: Amphenol FCI; Supplier Part Number: 609-4618-1-ND; Manufacturer Part Number: 10118194-0001LF; Value: 10118194-0001LF; Supplier: Digi-Key
J12 = PCIe Connector: Manufacturer: Samtec; Manufacturer Part Number: PCIE-036-02-S-D-RA; Value: PCIE-036-02-S-D-RA; Supplier: Mouser; Supplier Part Number: 200-PCIE03602SDRA
J13 = Double USB Connector: CONN RCPT TYPEA STACKED 8POS R/A; Manufacturer: Molex; Manufacturer Part Number: 0672984090; Supplier: Digi-Key; Value: 0672984090; Supplier Part Number: WM17130-ND
J17 = 4PinConnector: Manufacturer: Molex; Manufacturer Part Number: 0470531000; Supplier: Digi-Key; Supplier Part Number: WM4330-ND; Value: 0470531000
J19 = PJ-102A: CONN PWR JACK 2X5.5MM SOLDER; Manufacturer: CUI Devices; Manufacturer Part Number: PJ-102A; Value: PJ-102A; Supplier: Digi-Key; Supplier Part Number: CP-102A-ND
J20 = 4PinConnector: CONN HEADER R/A 4POS 2.5MM; Manufacturer: TE Connectivity AMP Connectors; Manufacturer Part Number: 171826-4; Supplier: Digi-Key; Supplier Part Number: A112643-ND; Value: 171826-4
L3 L5 = Inductor: FIXED IND 3.3UH 5A 21 MOHM SMD; Manufacturer: Bourns Inc.; Manufacturer Part Number: SRN6045TA-3R3Y; Value: SRN6045TA-3R3Y; Supplier: Digi-Key; Supplier Part Number: SRN6045TA-3R3YCT-ND
Module1 = ComputeModule4: CONN RCPT 100POS SMD GOLD; Manufacturer: Hirose Electric Co Ltd; Manufacturer Part Number: DF40C-100DS-0.4V(51); Value: Compute Module; Supplier: Digi-Key; Supplier Part Number: H11615CT-ND
Q1 = DMP3013SFV-7: Manufacturer: Diodes Incorporated; Value: DMP3013SFV-7; Manufacturer Part Number: DMP3013SFV-7; Supplier: Digi-Key; Supplier Part Number: DMP3013SFV-7DICT-ND
R1 R10 = Res Semi: 1 kOhms ±1% 0.063W; Manufacturer: Yageo; Manufacturer Part Number: RC0402FR-071KL; Value: 1k; Supplier: Digi-Key; Supplier Part Number: 311-1.00KLRCT-ND
R2 R3 = Res Semi: 470 Ohms ±1% 0.063W; Manufacturer: Yageo; Manufacturer Part Number: RC0402FR-07470RL; Value: 470R; Supplier: Digi-Key; Supplier Part Number: 311-470LRCT-ND
R4 R17 R18 = Res Semi: Value: NC
R5 = Res Semi: 0 Ohms Jumper 0.063W; Manufacturer: Yageo; Manufacturer Part Number: RC0402FR-070RL; Value: 0R; Supplier: Digi-Key; Supplier Part Number: 311-0.0LRCT-ND
R6-R8 R11 R28 = Res Semi: 2.2 kOhms ±1% 0.063W; Manufacturer: Yageo; Manufacturer Part Number: RC0402FR-072K2L; Value: 2.2k; Supplier: Digi-Key; Supplier Part Number: 311-2.20KLRCT-ND
R9 R22 = Res Semi: 10 Ohms ±1% 0.063W; Manufacturer: Yageo; Manufacturer Part Number: RC0402FR-0710RL; Value: 10R; Supplier: Digi-Key; Supplier Part Number: 311-10.0LRCT-ND
R12-R14 R16 R21 = Res Semi: 36 kOhms ±1% 0.063W; Manufacturer: Yageo; Manufacturer Part Number: RC0402FR-0736KL; Value: 36k; Supplier: Digi-Key; Supplier Part Number: 311-36.0KLRCT-ND
R15 R23 R26 R27 R29 = Res Semi: 12 kOhms ±1% 0.063W; Manufacturer: Yageo; Manufacturer Part Number: RC0402FR-0712KL; Value: 12k; Supplier: Digi-Key; Supplier Part Number: 311-12.0KLRCT-ND
R19 R20 = Res Semi: 510 kOhms ±1% 0.063W; Manufacturer: Yageo; Manufacturer Part Number: RC0402FR-07510KL; Value: 510k; Supplier: Digi-Key; Supplier Part Number: 311-510KLRCT-ND
R24 = Res Semi: 47 kOhms ±1% 0.063W; Manufacturer: Yageo; Manufacturer Part Number: RC0402FR-0747KL; Value: 47k; Supplier: Digi-Key; Supplier Part Number: 311-47.0KLRCT-ND
R25 = Res Semi: 20 kOhms ±1% 0.063W; Manufacturer: Yageo; Manufacturer Part Number: RC0402FR-0720KL; Value: 20k; Supplier: Digi-Key; Supplier Part Number: 311-20.0KLRCT-ND
R30 R36 = Res Semi: 15 kOhms ±1% 0.063W; Manufacturer: Yageo; Manufacturer Part Number: RC0402FR-0715KL; Value: 15k; Supplier: Digi-Key; Supplier Part Number: 311-15.0KLRCT-ND
U1 U2 U4 = TPD4EUSB30DQAR: TVS DIODE 5.5V 8V 10USON; MF: Texas Instruments; Supplier Part Number: 296-28063-1-ND; Supplier: Digi-Key; MP: TPD4EUSB30DQAR; Value: TPD4EUSB30DQAR
U3 = A70-112-331N126: RJ45 MAGNETIC JACK WITH LED; Manufacturer: LINK-PP; Value: A70-112-331N126; Supplier: Any; Manufacturer Part Number: A70-112-331N126
U5 U9 U14 = 74LVC1G07SE-7: IC BUF NON-INVERT 5.5V SOT353; Manufacturer: Nexperia; Manufacturer Part Number: 74LVC1G07SE-7; Supplier: Diodes Incorporated; Supplier Part Number: 74LVC1G07SE-7DICT-ND; Value: 74LVC1G07SE-7
U6 = USB2514B-I/M2: USB Hub Controller USB Interface 36-SQFN _6x6_; Manufacturer: Microchip; Manufacturer Part Number: USB2514B-I/M2; Supplier Part Number: Digi-Key; Supplier: Digi-Key; Value: USB2514B-I/M2
U7 = AP22653W6-7: LOAD SWITCH,SOT26,T&R,3K; Manufacturer: Diodes Incorporated; Manufacturer Part Number: AP22653W6-7; Supplier: Digi-Key; Supplier Part Number: 31-AP22653W6-7CT-ND; Value: AP22653W6-7
U8 = PCF85063AT/AAZ: IC RTC CLK/CALENDAR I2C 8SOIC; Manufacturer: NXP USA Inc.; Manufacturer Part Number: PCF85063AT/AY; Supplier: Digi-Key; Supplier Part Number: 568-12403-1-ND; Value: PCF85063AT/AY
U11 = EMC2301-1-ACZL-TR: IC MOTOR DRIVER 3V-3.6V 8MSOP; Manufacturer: Microchip Technology; Manufacturer Part Number: EMC2301-1-ACZL-TR; Supplier: Digi-Key; Supplier Part Number: EMC2301-1-ACZL-CT-ND; Value: EMC2301-1-ACZL-TR
U13 = FSUSB42MUX: USB Switch IC 1 Channel 10-MSOP; Manufacturer: ON Semiconductor; Supplier Part Number: FSUSB42MUXCT-ND; Value: FSUSB42MUX; Supplier: Digi-Key; Manufacturer Part Number: FSUSB42MUX
U15 U16 = AP64501SP-13: DCDC CONV HV BUCK SO-8EP; Manufacturer: Diodes Incorporated; Manufacturer Part Number: AP64501SP-13; Supplier: Digi-Key; Supplier Part Number: 31-AP64501SP-13CT-ND; Value: AP64501SP-13
U18 = RT9742GGJ5: IC PWR SWTCH N-CHAN 1:1 TSOT23-5; Manufacturer: Richtek USA Inc.; Manufacturer Part Number: RT9742GGJ5; Supplier: Digi-Key; Supplier Part Number: 1028-1436-1-ND; Value: RT9742GGJ5
Y1 = (no symbol name): CRYSTAL 24.0000MHZ 20PF SMD; Manufacturer: ECS Inc.; Manufacturer Part Number: ECS-240-20-5PX-TR; Supplier: Digi-Key; Supplier Part Number: XC1255CT-ND; Value: 24MHz
Y2 = (no symbol name): CRYSTAL 32.7680KHZ 12.5PF SMD; Manufacturer: NDK America, Inc.; Manufacturer Part Number: NX3215SA-32.768K-STD-MUA-8; Supplier: Digi-Key; Supplier Part Number: 644-1156-1-ND; Value: 32.768KHz

## Sheet SIM7600G.SchDoc
size A2
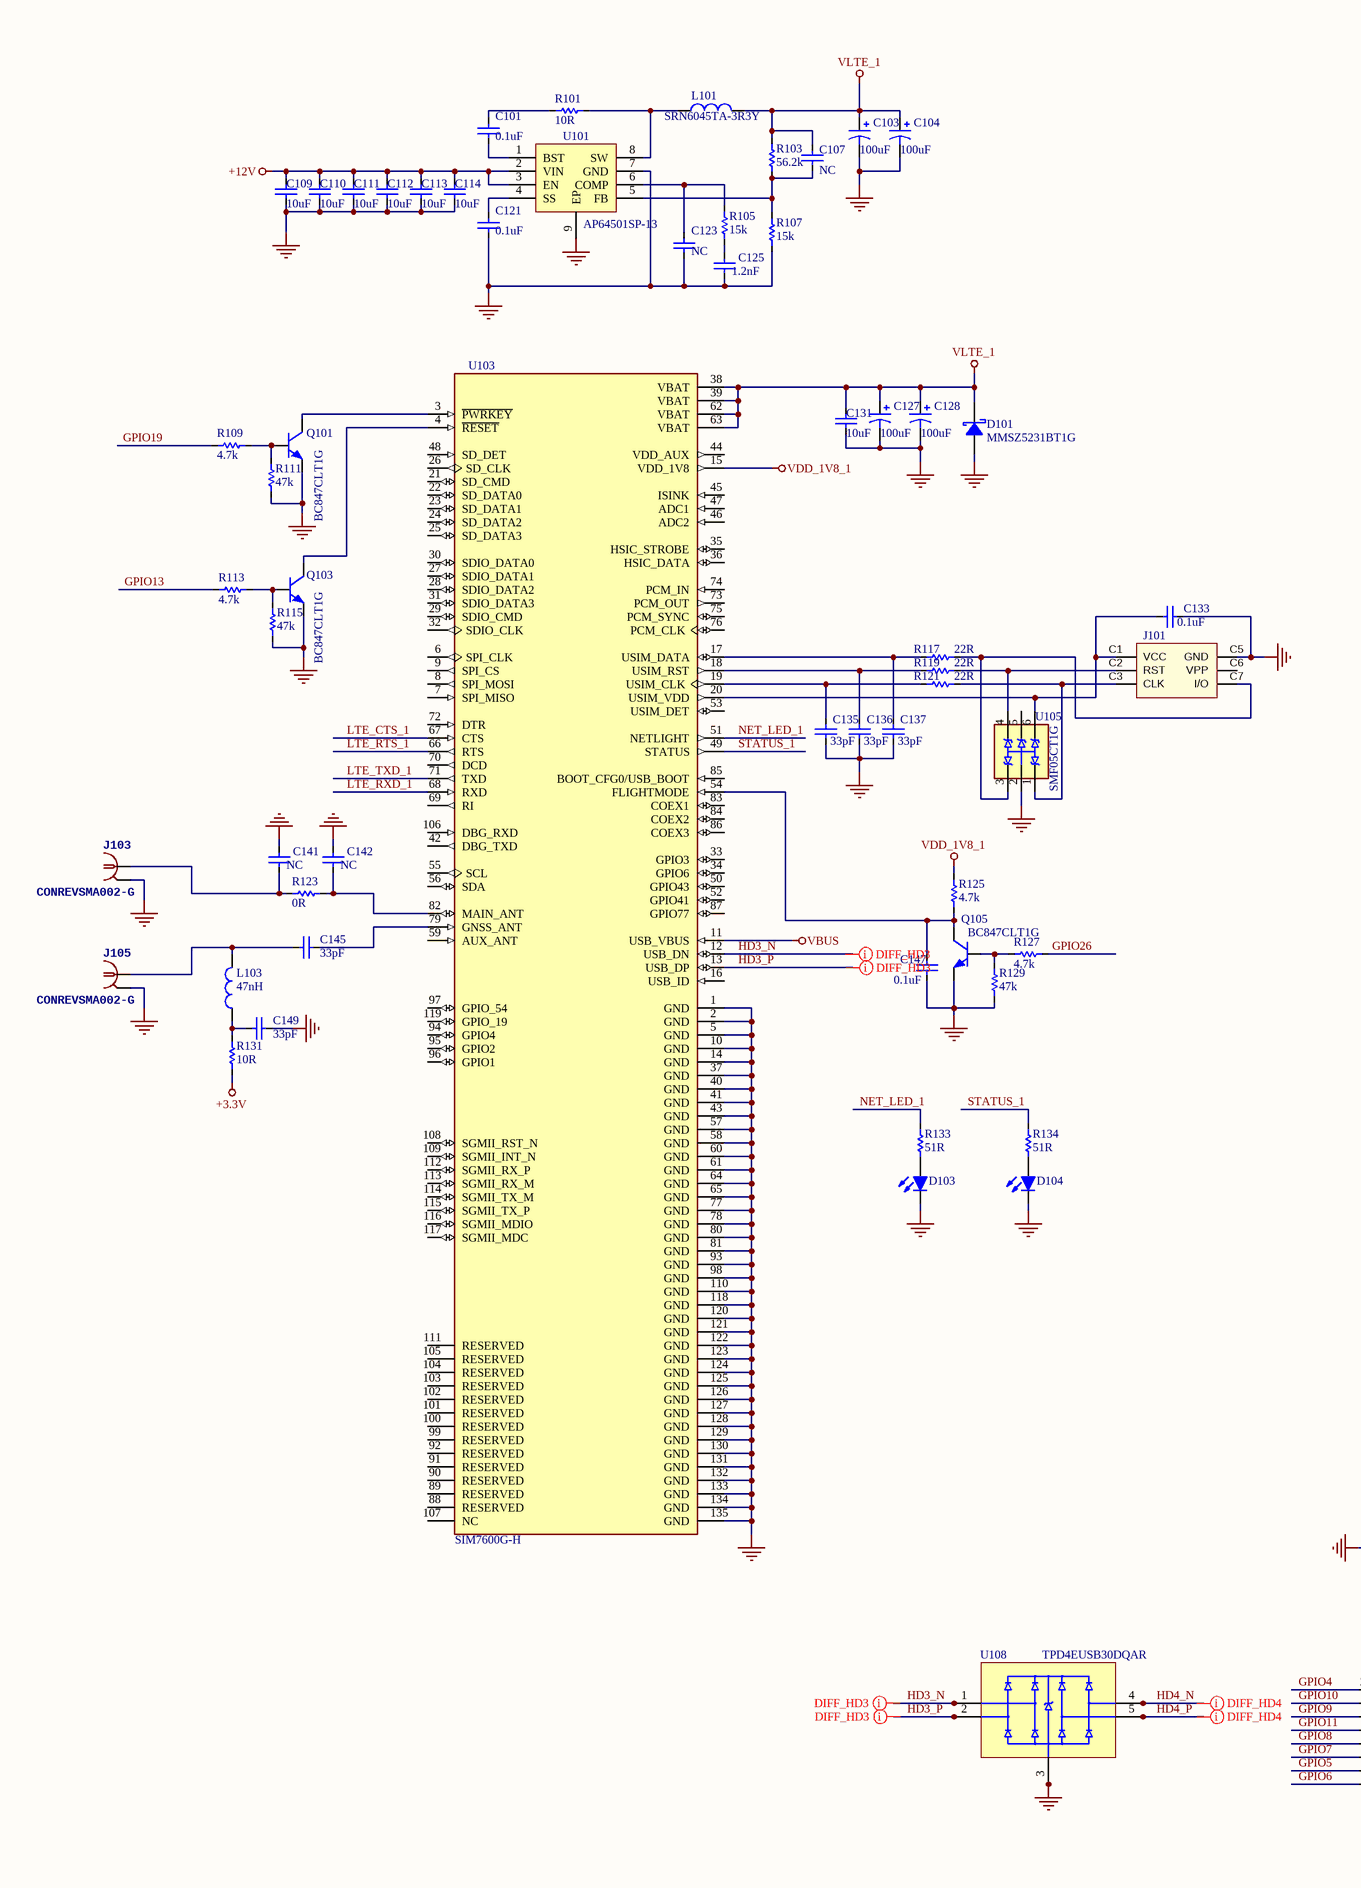
[diagram p4: SIM7600G.SchDoc, left]
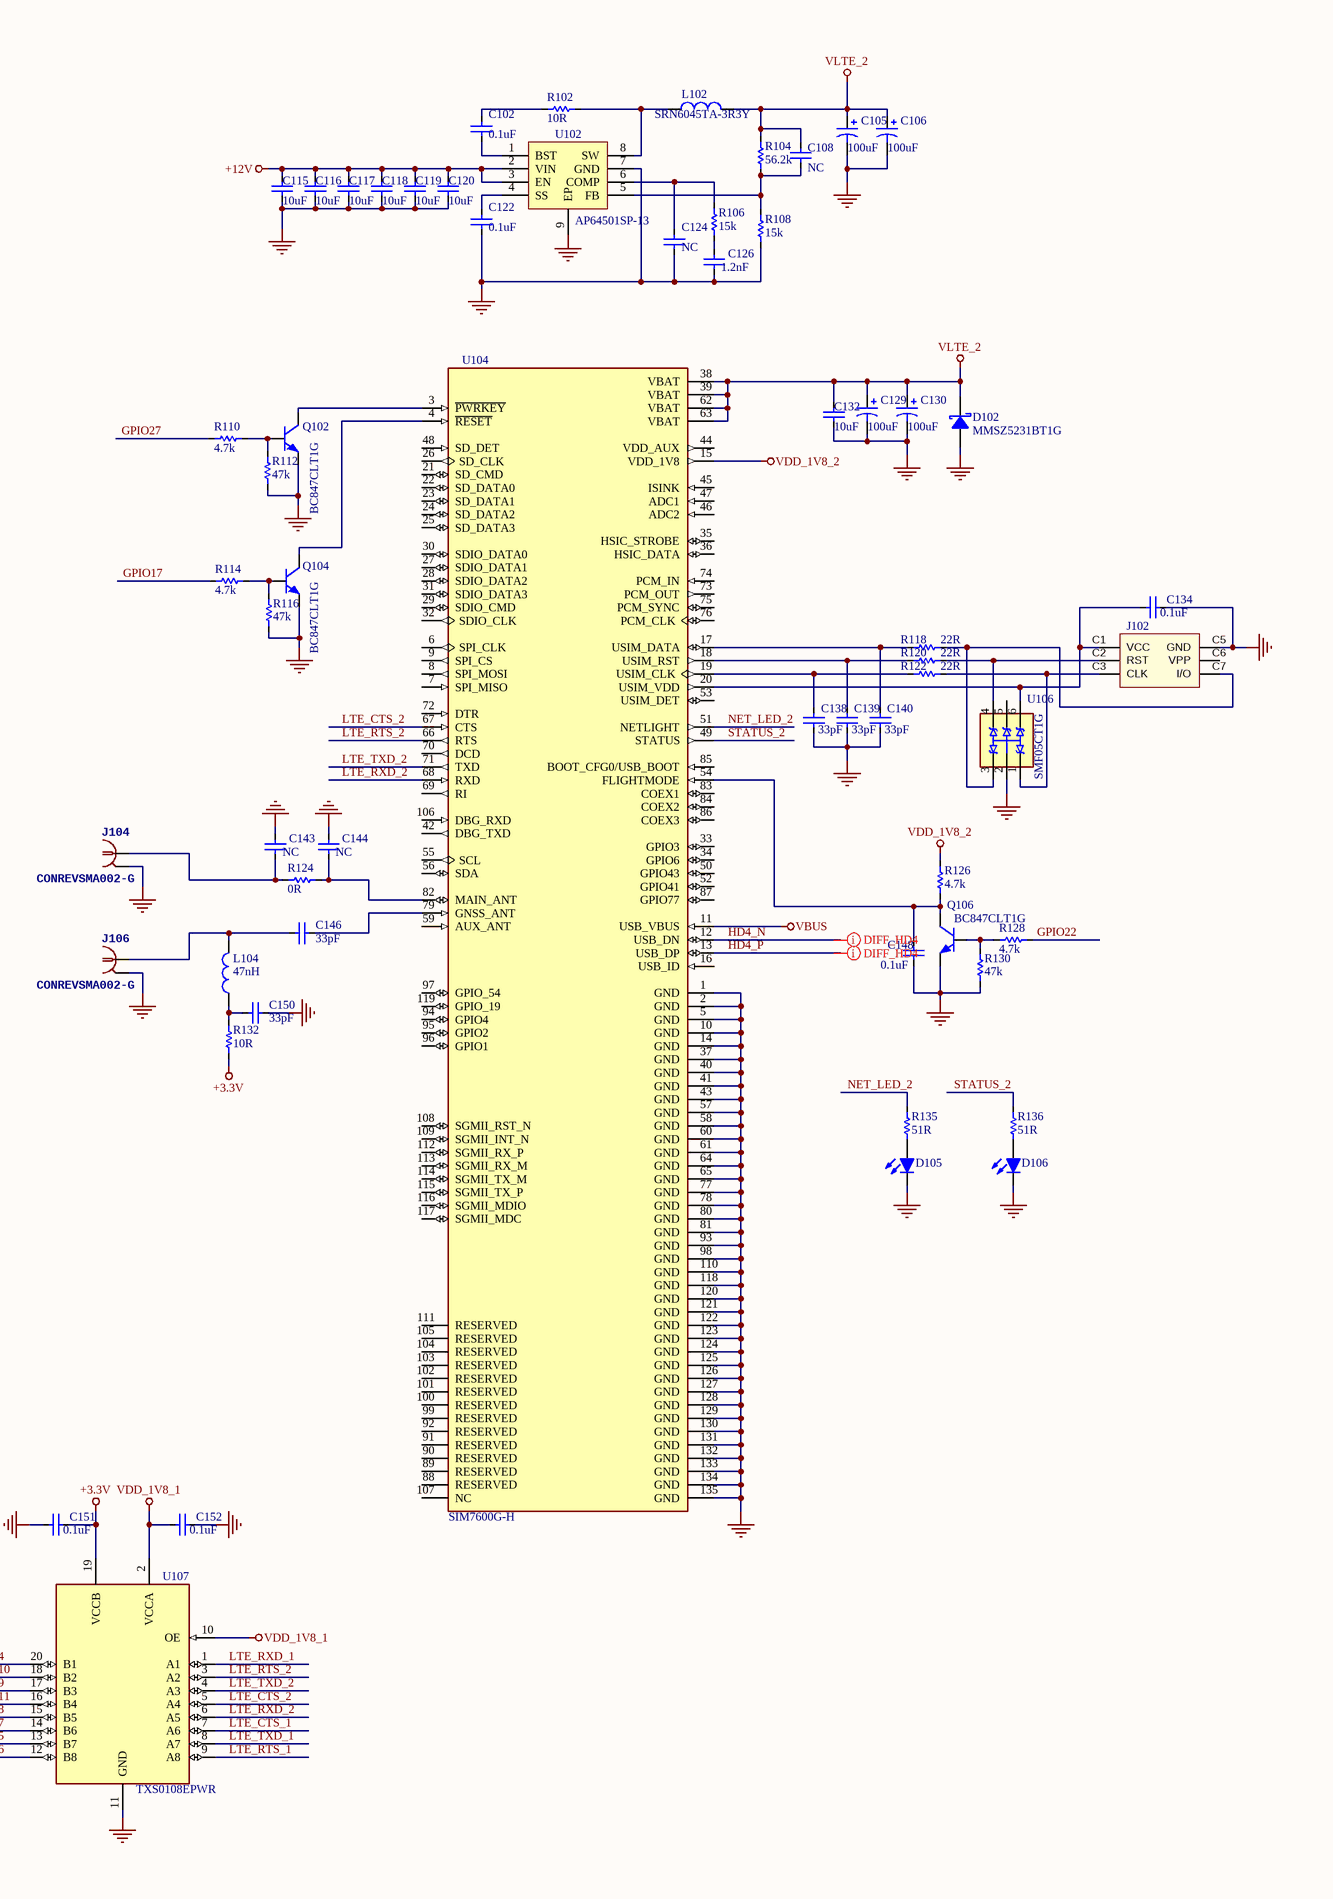
[diagram p5: SIM7600G.SchDoc, right]

### Parts
C101  0.1uF  [C_0402_1005Metric]
C102  0.1uF  [C_0402_1005Metric]
C103  100uF  [CP_EIA-7343-31_Kemet-D]
C104  100uF  [CP_EIA-7343-31_Kemet-D]
C105  100uF  [CP_EIA-7343-31_Kemet-D]
C106  100uF  [CP_EIA-7343-31_Kemet-D]
C107  NC  [C_0402_1005Metric]
C108  NC  [C_0402_1005Metric]
C109  10uF  [C_0805_2012Metric]
C110  10uF  [C_0805_2012Metric]
C111  10uF  [C_0805_2012Metric]
C112  10uF  [C_0805_2012Metric]
C113  10uF  [C_0805_2012Metric]
C114  10uF  [C_0805_2012Metric]
C115  10uF  [C_0805_2012Metric]
C116  10uF  [C_0805_2012Metric]
C117  10uF  [C_0805_2012Metric]
C118  10uF  [C_0805_2012Metric]
C119  10uF  [C_0805_2012Metric]
C120  10uF  [C_0805_2012Metric]
C121  0.1uF  [C_0402_1005Metric]
C122  0.1uF  [C_0402_1005Metric]
C123  NC  [C_0402_1005Metric]
C124  NC  [C_0402_1005Metric]
C125  1.2nF  [C_0402_1005Metric]
C126  1.2nF  [C_0402_1005Metric]
C127  100uF  [CP_EIA-7343-31_Kemet-D]
C128  100uF  [CP_EIA-7343-31_Kemet-D]
C129  100uF  [CP_EIA-7343-31_Kemet-D]
C130  100uF  [CP_EIA-7343-31_Kemet-D]
C131  10uF  [C_0805_2012Metric]
C132  10uF  [C_0805_2012Metric]
C133  0.1uF  [C_0402_1005Metric]
C134  0.1uF  [C_0402_1005Metric]
C135  33pF  [C_0402_1005Metric]
C136  33pF  [C_0402_1005Metric]
C137  33pF  [C_0402_1005Metric]
C138  33pF  [C_0402_1005Metric]
C139  33pF  [C_0402_1005Metric]
C140  33pF  [C_0402_1005Metric]
C141  NC  [C_0402_1005Metric]
C142  NC  [C_0402_1005Metric]
C143  NC  [C_0402_1005Metric]
C144  NC  [C_0402_1005Metric]
C145  33pF  [C_0402_1005Metric]
C146  33pF  [C_0402_1005Metric]
C147  0.1uF  [C_0402_1005Metric]
C148  0.1uF  [C_0402_1005Metric]
C149  33pF  [C_0402_1005Metric]
C150  33pF  [C_0402_1005Metric]
C151  0.1uF  [C_0402_1005Metric]
C152  0.1uF  [C_0402_1005Metric]
D101  MMSZ5231BT1G  [SOD-123]
D102  MMSZ5231BT1G  [SOD-123]
D103  SML-D12M8WT86  [LED_0603_1608Metric]  (value not drawn)
D104  SML-D12M8WT86  [LED_0603_1608Metric]  (value not drawn)
D105  SML-D12M8WT86  [LED_0603_1608Metric]  (value not drawn)
D106  SML-D12M8WT86  [LED_0603_1608Metric]  (value not drawn)
J101  78646-3001  [78646-3001]  (value not drawn)
J102  78646-3001  [78646-3001]  (value not drawn)
J103  CONREVSMA002-G  [LINX_CONREVSMA002-G]
J104  CONREVSMA002-G  [LINX_CONREVSMA002-G]
J105  CONREVSMA002-G  [LINX_CONREVSMA002-G]
J106  CONREVSMA002-G  [LINX_CONREVSMA002-G]
L101  SRN6045TA-3R3Y  [L_Bourns_SRN6045TA]
L102  SRN6045TA-3R3Y  [L_Bourns_SRN6045TA]
L103  47nH  [SMD_R(0402)]
L104  47nH  [SMD_R(0402)]
Q101  BC847CLT1G  [SOT23-3]
Q102  BC847CLT1G  [SOT23-3]
Q103  BC847CLT1G  [SOT23-3]
Q104  BC847CLT1G  [SOT23-3]
Q105  BC847CLT1G  [SOT23-3]
Q106  BC847CLT1G  [SOT23-3]
R101  10R  [R_0402_1005Metric]
R102  10R  [R_0402_1005Metric]
R103  56.2k  [R_0402_1005Metric]
R104  56.2k  [R_0402_1005Metric]
R105  15k  [R_0402_1005Metric]
R106  15k  [R_0402_1005Metric]
R107  15k  [R_0402_1005Metric]
R108  15k  [R_0402_1005Metric]
R109  4.7k  [R_0402_1005Metric]
R110  4.7k  [R_0402_1005Metric]
R111  47k  [R_0402_1005Metric]
R112  47k  [R_0402_1005Metric]
R113  4.7k  [R_0402_1005Metric]
R114  4.7k  [R_0402_1005Metric]
R115  47k  [R_0402_1005Metric]
R116  47k  [R_0402_1005Metric]
R117  22R  [R_0402_1005Metric]
R118  22R  [R_0402_1005Metric]
R119  22R  [R_0402_1005Metric]
R120  22R  [R_0402_1005Metric]
R121  22R  [R_0402_1005Metric]
R122  22R  [R_0402_1005Metric]
R123  0R  [R_0402_1005Metric]
R124  0R  [R_0402_1005Metric]
R125  4.7k  [R_0402_1005Metric]
R126  4.7k  [R_0402_1005Metric]
R127  4.7k  [R_0402_1005Metric]
R128  4.7k  [R_0402_1005Metric]
R129  47k  [R_0402_1005Metric]
R130  47k  [R_0402_1005Metric]
R131  10R  [R_0402_1005Metric]
R132  10R  [R_0402_1005Metric]
R133  51R  [R_0402_1005Metric]
R134  51R  [R_0402_1005Metric]
R135  51R  [R_0402_1005Metric]
R136  51R  [R_0402_1005Metric]
U101  AP64501SP-13  [SOIC-8-1EP_3.9x4.9mm_P1.27mm_EP2.95x4.9mm_Mask2.71x3.4mm_ThermalVias]
U102  AP64501SP-13  [SOIC-8-1EP_3.9x4.9mm_P1.27mm_EP2.95x4.9mm_Mask2.71x3.4mm_ThermalVias]
U103  SIM7600G-H  [IC_SIM7600G]
U104  SIM7600G-H  [IC_SIM7600G]
U105  SMF05CT1G  [SOT-363]
U106  SMF05CT1G  [SOT-363]
U107  TXS0108EPWR  [SOP65P640X120-20N]
U108  TPD4EUSB30DQAR  [USON-10_2.5x1.0mm_P0.5mm]

### Nets
+3.3V: C151.2 R131.1 R132.1 U107.19(VCCB)
+12V: C109.1 C110.1 C111.1 C112.1 C113.1 C114.1 C115.1 C116.1 C117.1 C118.1 C119.1 C120.1 U101.2(VIN) U101.3(EN) U102.2(VIN) U102.3(EN)
GND: C103.2 C104.2 C105.2 C106.2 C109.2 C110.2 C111.2 C112.2 C113.2 C114.2 C115.2 C116.2 C117.2 C118.2 C119.2 C120.2 C121.2 C122.2 C123.2 C124.2 C125.2 C126.2 C127.2 C128.2 C129.2 C130.2 C131.2 C132.2 C133.2 C134.2 C135.1 C136.1 C137.1 C138.1 C139.1 C140.1 C141.1 C142.1 C143.1 C144.1 C147.1 C148.1 C149.1 C150.1 C151.1 C152.2 D101.A D102.A D103.1(K) D104.1(K) D105.1(K) D106.1(K) J101.C5(GND) J102.C5(GND) J103.2(GND) J104.2(GND) J105.2(GND) J106.2(GND) Q101.2(E) Q102.2(E) Q103.2(E) Q104.2(E) Q105.2(E) Q106.2(E) R107.2 R108.2 R111.1 R112.1 R115.1 R116.1 R129.1 R130.1 U101.7(GND) U101.9(EP) U102.7(GND) U102.9(EP) U103.1(GND) U103.2(GND) U103.5(GND) U103.10(GND) U103.14(GND) U103.37(GND) U103.40(GND) U103.41(GND) U103.43(GND) U103.57(GND) U103.58(GND) U103.60(GND) U103.61(GND) U103.64(GND) U103.65(GND) U103.77(GND) U103.78(GND) U103.80(GND) U103.81(GND) U103.93(GND) U103.98(GND) U103.110(GND) U103.118(GND) U103.120(GND) U103.121(GND) U103.122(GND) U103.123(GND) U103.124(GND) U103.125(GND) U103.126(GND) U103.127(GND) U103.128(GND) U103.129(GND) U103.130(GND) U103.131(GND) U103.132(GND) U103.133(GND) U103.134(GND) U103.135(GND) U104.1(GND) U104.2(GND) U104.5(GND) U104.10(GND) U104.14(GND) U104.37(GND) U104.40(GND) U104.41(GND) U104.43(GND) U104.57(GND) U104.58(GND) U104.60(GND) U104.61(GND) U104.64(GND) U104.65(GND) U104.77(GND) U104.78(GND) U104.80(GND) U104.81(GND) U104.93(GND) U104.98(GND) U104.110(GND) U104.118(GND) U104.120(GND) U104.121(GND) U104.122(GND) U104.123(GND) U104.124(GND) U104.125(GND) U104.126(GND) U104.127(GND) U104.128(GND) U104.129(GND) U104.130(GND) U104.131(GND) U104.132(GND) U104.133(GND) U104.134(GND) U104.135(GND) U105.2(A) U106.2(A) U107.11(GND) U108.3(GND_3) U108.8(GND_8)
VBUS: U103.11(USB_VBUS) U104.11(USB_VBUS)
VDD_1V8_1: C152.1 R125.1 U103.15(VDD_1V8) U107.2(VCCA) U107.10(OE)
VDD_1V8_2: R126.1 U104.15(VDD_1V8)
VLTE_1: C103.1 C104.1 C107.1 C127.1 C128.1 C131.1 D101.K L101.2 R103.1 U103.38(VBAT) U103.39(VBAT) U103.62(VBAT) U103.63(VBAT)
VLTE_2: C105.1 C106.1 C108.1 C129.1 C130.1 C132.1 D102.K L102.2 R104.1 U104.38(VBAT) U104.39(VBAT) U104.62(VBAT) U104.63(VBAT)
GPIO4: U107.20(B1)
GPIO5: U107.13(B7)
GPIO6: U107.12(B8)
GPIO7: U107.14(B6)
GPIO8: U107.15(B5)
GPIO9: U107.17(B3)
GPIO10: U107.18(B2)
GPIO11: U107.16(B4)
GPIO13: R113.2
GPIO17: R114.2
GPIO19: R109.2
GPIO22: R128.1
GPIO26: R127.1
GPIO27: R110.2
HD3_N: U103.12(USB_DN) U108.1(D1+) U108.10(NC_10)
HD3_P: U103.13(USB_DP) U108.2(D1-) U108.9(NC_9)
HD4_N: U104.12(USB_DN) U108.4(D2+) U108.7(NC_7)
HD4_P: U104.13(USB_DP) U108.5(D2-) U108.6(NC_6)
LTE_CTS_1: U103.67(CTS) U107.7(A6)
LTE_CTS_2: U104.67(CTS) U107.5(A4)
LTE_RTS_1: U103.66(RTS) U107.9(A8)
LTE_RTS_2: U104.66(RTS) U107.3(A2)
LTE_RXD_1: U103.68(RXD) U107.1(A1)
LTE_RXD_2: U104.68(RXD) U107.6(A5)
LTE_TXD_1: U103.71(TXD) U107.8(A7)
LTE_TXD_2: U104.71(TXD) U107.4(A3)
NET_LED_1: R133.1 U103.51(NETLIGHT)
NET_LED_2: R135.1 U104.51(NETLIGHT)
STATUS_1: R134.1 U103.49(STATUS)
STATUS_2: R136.1 U104.49(STATUS)
NetC101_1: C101.1 R101.2
NetC101_2: C101.2 U101.1(BST)
NetC102_1: C102.1 R102.2
NetC102_2: C102.2 U102.1(BST)
NetC107_2: C107.2 R103.2 R107.1 U101.5(FB)
NetC108_2: C108.2 R104.2 R108.1 U102.5(FB)
NetC121_1: C121.1 U101.4(SS)
NetC122_1: C122.1 U102.4(SS)
NetC123_1: C123.1 R105.1 U101.6(COMP)
NetC124_1: C124.1 R106.1 U102.6(COMP)
NetC125_1: C125.1 R105.2
NetC126_1: C126.1 R106.2
NetC133_1: C133.1 J101.C1(VCC) U103.20(USIM_VDD) U105.6(C5)
NetC134_1: C134.1 J102.C1(VCC) U104.20(USIM_VDD) U106.6(C5)
NetC135_2: C135.2 R121.1 U103.19(USIM_CLK)
NetC136_2: C136.2 R119.1 U103.18(USIM_RST)
NetC137_2: C137.2 R117.1 U103.17(USIM_DATA)
NetC138_2: C138.2 R122.1 U104.19(USIM_CLK)
NetC139_2: C139.2 R120.1 U104.18(USIM_RST)
NetC140_2: C140.2 R118.1 U104.17(USIM_DATA)
NetC141_2: C141.2 J103.1 R123.1
NetC142_2: C142.2 R123.2 U103.82(MAIN_ANT)
NetC143_2: C143.2 J104.1 R124.1
NetC144_2: C144.2 R124.2 U104.82(MAIN_ANT)
NetC145_1: C145.1 U103.79(GNSS_ANT)
NetC145_2: C145.2 J105.1 L103.2
NetC146_1: C146.1 U104.79(GNSS_ANT)
NetC146_2: C146.2 J106.1 L104.2
NetC147_2: C147.2 Q105.3(C) R125.2 U103.54(FLIGHTMODE)
NetC148_2: C148.2 Q106.3(C) R126.2 U104.54(FLIGHTMODE)
NetC149_2: C149.2 L103.1 R131.2
NetC150_2: C150.2 L104.1 R132.2
NetD103_2: D103.2(A) R133.2
NetD104_2: D104.2(A) R134.2
NetD105_2: D105.2(A) R135.2
NetD106_2: D106.2(A) R136.2
NetJ101_C2: J101.C2(RST) R119.2 U105.4(C3)
NetJ101_C3: J101.C3(CLK) R121.2 U105.1(C1)
NetJ101_C7: J101.C7(I/O) R117.2 U105.3(C2)
NetJ102_C2: J102.C2(RST) R120.2 U106.4(C3)
NetJ102_C3: J102.C3(CLK) R122.2 U106.1(C1)
NetJ102_C7: J102.C7(I/O) R118.2 U106.3(C2)
NetL101_1: L101.1 R101.1 U101.8(SW)
NetL102_1: L102.1 R102.1 U102.8(SW)
NetQ101_1: Q101.1(B) R109.1 R111.2
NetQ101_3: Q101.3(C) U103.3(~{PWRKEY})
NetQ102_1: Q102.1(B) R110.1 R112.2
NetQ102_3: Q102.3(C) U104.3(~{PWRKEY})
NetQ103_1: Q103.1(B) R113.1 R115.2
NetQ103_3: Q103.3(C) U103.4(~{RESET})
NetQ104_1: Q104.1(B) R114.1 R116.2
NetQ104_3: Q104.3(C) U104.4(~{RESET})
NetQ105_1: Q105.1(B) R127.2 R129.2
NetQ106_1: Q106.1(B) R128.2 R130.2

Not connected (* = marked no-connect by the designer): J101 C6(VPP); J102 C6(VPP); U103 6(SPI_CLK) 7(SPI_MISO) 8(SPI_MOSI) 9(SPI_CS) 16(USB_ID) 21(SD_CMD) 22(SD_DATA0) 23(SD_DATA1) 24(SD_DATA2) 25(SD_DATA3) 26(SD_CLK) 27(SDIO_DATA1) 28(SDIO_DATA2) 29(SDIO_CMD) 30(SDIO_DATA0) 31(SDIO_DATA3) 32(SDIO_CLK) 33(GPIO3) 34(GPIO6) 35(HSIC_STROBE) 36(HSIC_DATA) 42(DBG_TXD) 44(VDD_AUX) 45(ISINK) 46(ADC2) 47(ADC1) 48(SD_DET) 50(GPIO43) 52(GPIO41) 53(USIM_DET) 55(SCL) 56(SDA) 59(AUX_ANT) 69(RI) 70(DCD) 72(DTR) 73(PCM_OUT) 74(PCM_IN) 75(PCM_SYNC) 76(PCM_CLK) 83(COEX1) 84(COEX2) 85(BOOT_CFG0/USB_BOOT) 86(COEX3) 87(GPIO77) 88(RESERVED) 89(RESERVED) 90(RESERVED) 91(RESERVED) 92(RESERVED) 94(GPIO4) 95(GPIO2) 96(GPIO1) 97(GPIO_54) 99(RESERVED) 100(RESERVED) 101(RESERVED) 102(RESERVED) 103(RESERVED) 104(RESERVED) 105(RESERVED) 106(DBG_RXD) 107(NC) 108(SGMII_RST_N) 109(SGMII_INT_N) 111(RESERVED) 112(SGMII_RX_P) 113(SGMII_RX_M) 114(SGMII_TX_M) 115(SGMII_TX_P) 116(SGMII_MDIO) 117(SGMII_MDC) 119(GPIO_19); U104 6(SPI_CLK) 7(SPI_MISO) 8(SPI_MOSI) 9(SPI_CS) 16(USB_ID) 21(SD_CMD) 22(SD_DATA0) 23(SD_DATA1) 24(SD_DATA2) 25(SD_DATA3) 26(SD_CLK) 27(SDIO_DATA1) 28(SDIO_DATA2) 29(SDIO_CMD) 30(SDIO_DATA0) 31(SDIO_DATA3) 32(SDIO_CLK) 33(GPIO3) 34(GPIO6) 35(HSIC_STROBE) 36(HSIC_DATA) 42(DBG_TXD) 44(VDD_AUX) 45(ISINK) 46(ADC2) 47(ADC1) 48(SD_DET) 50(GPIO43) 52(GPIO41) 53(USIM_DET) 55(SCL) 56(SDA) 59(AUX_ANT) 69(RI) 70(DCD) 72(DTR) 73(PCM_OUT) 74(PCM_IN) 75(PCM_SYNC) 76(PCM_CLK) 83(COEX1) 84(COEX2) 85(BOOT_CFG0/USB_BOOT) 86(COEX3) 87(GPIO77) 88(RESERVED) 89(RESERVED) 90(RESERVED) 91(RESERVED) 92(RESERVED) 94(GPIO4) 95(GPIO2) 96(GPIO1) 97(GPIO_54) 99(RESERVED) 100(RESERVED) 101(RESERVED) 102(RESERVED) 103(RESERVED) 104(RESERVED) 105(RESERVED) 106(DBG_RXD) 107(NC) 108(SGMII_RST_N) 109(SGMII_INT_N) 111(RESERVED) 112(SGMII_RX_P) 113(SGMII_RX_M) 114(SGMII_TX_M) 115(SGMII_TX_P) 116(SGMII_MDIO) 117(SGMII_MDC) 119(GPIO_19); U105 5(C4); U106 5(C4)

### Layout directives
differential pair; differential pair class DIFF_100Ohm_HD3; differential pair class DIFF_HD3; net class HD3: HD3_N, HD3_P
differential pair; differential pair class DIFF_100Ohm_HD4; differential pair class DIFF_HD4; net class HD4: HD4_N, HD4_P

### Library data of the parts
C101 C102 C121 C122 C133 C134 C147 C148 C151 C152 = Cap: as C1 on sheet RaspComputeModule_4_IO; Supplier: Digi-Key; Supplier Part Number: 311-3342-1-ND; Value: 0.1uF
C103-C106 C127-C130 = Cap Pol1: as C16 on sheet RaspComputeModule_4_IO; Supplier: Digi-Key; Supplier Part Number: 478-3918-1-ND; Value: 100uF
C107 C108 C123 C124 C141-C144 = Cap: Value: NC
C109-C120 C131 C132 = Cap: as C2 on sheet RaspComputeModule_4_IO; Supplier: Digi-Key; Supplier Part Number: 490-10514-1-ND; Vaule: 10uF
C125 C126 = Cap: 1200pF ±10% 50V; Manufacturer: Yageo; Manufacturer Part Number: GRM155R71H122KA01J; Supplier: Digi-Key; Supplier Part Number: 490-6352-1-ND; Value: 1.2nF
C135-C140 C145 C146 C149 C150 = Cap: 33pF ±1% 50V; Manufacturer: Yageo; Manufacturer Part Number: CC0402FRNPO9BN330; Supplier: Digi-Key; Supplier Part Number: 311-3732-1-ND; Value: 33pF
D101 D102 = Diode 10TQ035: DIODE ZENER 5.1V 500MW SOD123; Manufacturer: ON Semiconductor; Value: MMSZ5231BT1G; Supplier: Digi-Key; Supplier Part Number: MMSZ5231BT1GOSCT-ND; Manufacturer Part Number: MMSZ5231BT1G
D103-D106 = LED1: LED GREEN DIFFUSED 0603 SMD; Manufacturer: Rohm Semiconductor; Supplier: Digi-Key; Supplier Part Number: 511-1578-1-ND; Manufacturer Part Number: SML-D12M8WT86; Value: SML-D12M8WT86
J101 J102 = CN SimCard_63: CONN MICRO SIM CARD PUSH-PULL; Manufacturer: Molex; Value: 78646-3001; Manufacturer Part Number: 78646-3001; Supplier Part Number: 538-78646-3001; Supplier: Mouser
J103-J106 = SMA-SMD: CONN SMA JACK STR EDGE MNT; Manufacturer: Linx Technologies Inc.; Manufacturer Part Number: CONREVSMA002-G; Supplier: Digi-Key; Supplier Part Number: CONREVSMA002-G-ND; Value: CONREVSMA002-G
L101 L102 = Inductor: as L3 on sheet RaspComputeModule_4_IO; Manufacturer Part Number: SRN6045TA-3R3Y; Value: SRN6045TA-3R3Y; Supplier: Digi-Key; Supplier Part Number: SRN6045TA-3R3YCT-ND
L103 L104 = Inductor: FIXED IND 47NH 210MA 1.08 OHM; Manufacturer Part Number: LQW15AN47NJ00D; Manufacturer: Murata; Value: 47nH; Supplier: Digi-Key; Supplier Part Number: 490-1154-1-ND
Q101-Q106 = 2N3904: TRANS NPN 45V 100MA SOT23-3; Manufacturer: ON Semiconductor; Supplier: Digi-Key; Manufacturer Part Number: BC847CLT1G; Supplier Part Number: BC847CLT1GOSCT-ND; Value: BC847CLT1G
R101 R102 R131 R132 = Res Semi: as R9 on sheet RaspComputeModule_4_IO; Value: 10R; Supplier: Digi-Key; Supplier Part Number: 311-10.0LRCT-ND
R103 R104 = Res Semi: 56.2 kOhms ±1% 0.063W; Manufacturer: Yageo; Manufacturer Part Number: RC0402FR-0756K2L; Value: 56.2k; Supplier: Digi-Key; Supplier Part Number: YAG3187CT-ND
R105-R108 = Res Semi: as R30 on sheet RaspComputeModule_4_IO; Value: 15k; Supplier: Digi-Key; Supplier Part Number: 311-15.0KLRCT-ND
R109 R110 R113 R114 R125-R128 = Res Semi: 4.7 kOhms ±1% 0.063W; Manufacturer: Yageo; Manufacturer Part Number: RC0402FR-074K7L; Value: 4.7k; Supplier: Digi-Key; Supplier Part Number: 311-4.7KLRCT-ND
R111 R112 R115 R116 R129 R130 = Res Semi: as R24 on sheet RaspComputeModule_4_IO; Value: 47k; Supplier: Digi-Key; Supplier Part Number: 311-47.0KLRCT-ND
R117-R122 = Res Semi: 22 Ohms ±1% 0.063W; Manufacturer: Yageo; Manufacturer Part Number: RC0402FR-0722RL; Value: 22R; Supplier: Digi-Key; Supplier Part Number: 311-22.0LRCT-ND
R123 R124 = Res Semi: as R5 on sheet RaspComputeModule_4_IO; Value: 0R; Supplier: Digi-Key; Supplier Part Number: 311-0.0LRCT-ND
R133-R136 = Res Semi: 51 Ohms ±1% 0.063W; Manufacturer: Yageo; Manufacturer Part Number: RC0402FR-0751RL; Value: 51R; Supplier: Digi-Key; Supplier Part Number: 311-51.0LRCT-ND
U101 U102 = AP64501SP-13: as U15 on sheet RaspComputeModule_4_IO; Manufacturer Part Number: AP64501SP-13; Supplier: Digi-Key; Supplier Part Number: 31-AP64501SP-13CT-ND; Value: AP64501SP-13
U103 U104 = SIM7600G: LTE Cat-4 Module; Manufacturer: Simcom; Value: SIM7600G-H; Manufacturer Part Number: SIM7600G-H; Supplier: Any
U105 U106 = SMF05CT1G: TRANS VOLTAGE SUPPRESSOR DIODE,; Manufacturer: ON Semiconductor; Manufacturer Part Number: SMF05CT1G; Value: SMF05CT1G; Supplier: Mouser; Supplier Part Number: 863-SMF05CT1G
U107 = TXS0108EPWR: 8-Bit Bidirectional Voltage-Level Shifter For Open-Drain And Push-Pull Application; Manufacturer: Texas Instruments; Value: TXS0108EPWR; Manufacturer Part Number: TXS0108EPWR; Supplier: Digi-Key; Supplier Part Number: 296-23011-1-ND
U108 = TPD4EUSB30DQAR: as U1 on sheet RaspComputeModule_4_IO; Supplier Part Number: 296-28063-1-ND; Supplier: Digi-Key; MP: TPD4EUSB30DQAR; Value: TPD4EUSB30DQAR

## Nets that join several sheets
+3.3V: RaspComputeModule_4_IO (37 pins), SIM7600G (C151.2 R131.1 R132.1 U107.19)
+12V: RaspComputeModule_4_IO (30 pins), SIM7600G (16 pins)
GND: RaspComputeModule_4_IO (202 pins), SIM7600G (159 pins)
VBUS: RaspComputeModule_4_IO (8 pins), SIM7600G (U103.11 U104.11)
GPIO4: RaspComputeModule_4_IO (J8.7 Module1.54), SIM7600G (U107.20)
GPIO5: RaspComputeModule_4_IO (J8.29 Module1.34), SIM7600G (U107.13)
GPIO6: RaspComputeModule_4_IO (J8.31 Module1.30), SIM7600G (U107.12)
GPIO7: RaspComputeModule_4_IO (J8.26 Module1.37), SIM7600G (U107.14)
GPIO8: RaspComputeModule_4_IO (J8.24 Module1.39), SIM7600G (U107.15)
GPIO9: RaspComputeModule_4_IO (J8.21 Module1.40), SIM7600G (U107.17)
GPIO10: RaspComputeModule_4_IO (J8.19 Module1.44), SIM7600G (U107.18)
GPIO11: RaspComputeModule_4_IO (J8.23 Module1.38), SIM7600G (U107.16)
GPIO13: RaspComputeModule_4_IO (J8.33 Module1.28), SIM7600G (R113.2)
GPIO17: RaspComputeModule_4_IO (J8.11 Module1.50), SIM7600G (R114.2)
GPIO19: RaspComputeModule_4_IO (J8.35 Module1.26), SIM7600G (R109.2)
GPIO22: RaspComputeModule_4_IO (J8.15 Module1.46), SIM7600G (R128.1)
GPIO26: RaspComputeModule_4_IO (J8.37 Module1.24), SIM7600G (R127.1)
GPIO27: RaspComputeModule_4_IO (J8.13 Module1.48), SIM7600G (R110.2)
HD3_N: RaspComputeModule_4_IO (U6.6), SIM7600G (U103.12 U108.1 U108.10)
HD3_P: RaspComputeModule_4_IO (U6.7), SIM7600G (U103.13 U108.2 U108.9)
HD4_N: RaspComputeModule_4_IO (U6.8), SIM7600G (U104.12 U108.4 U108.7)
HD4_P: RaspComputeModule_4_IO (U6.9), SIM7600G (U104.13 U108.5 U108.6)